# Altium project FLEXI_HAL_2000.PrjPCB (part 1 of 3)
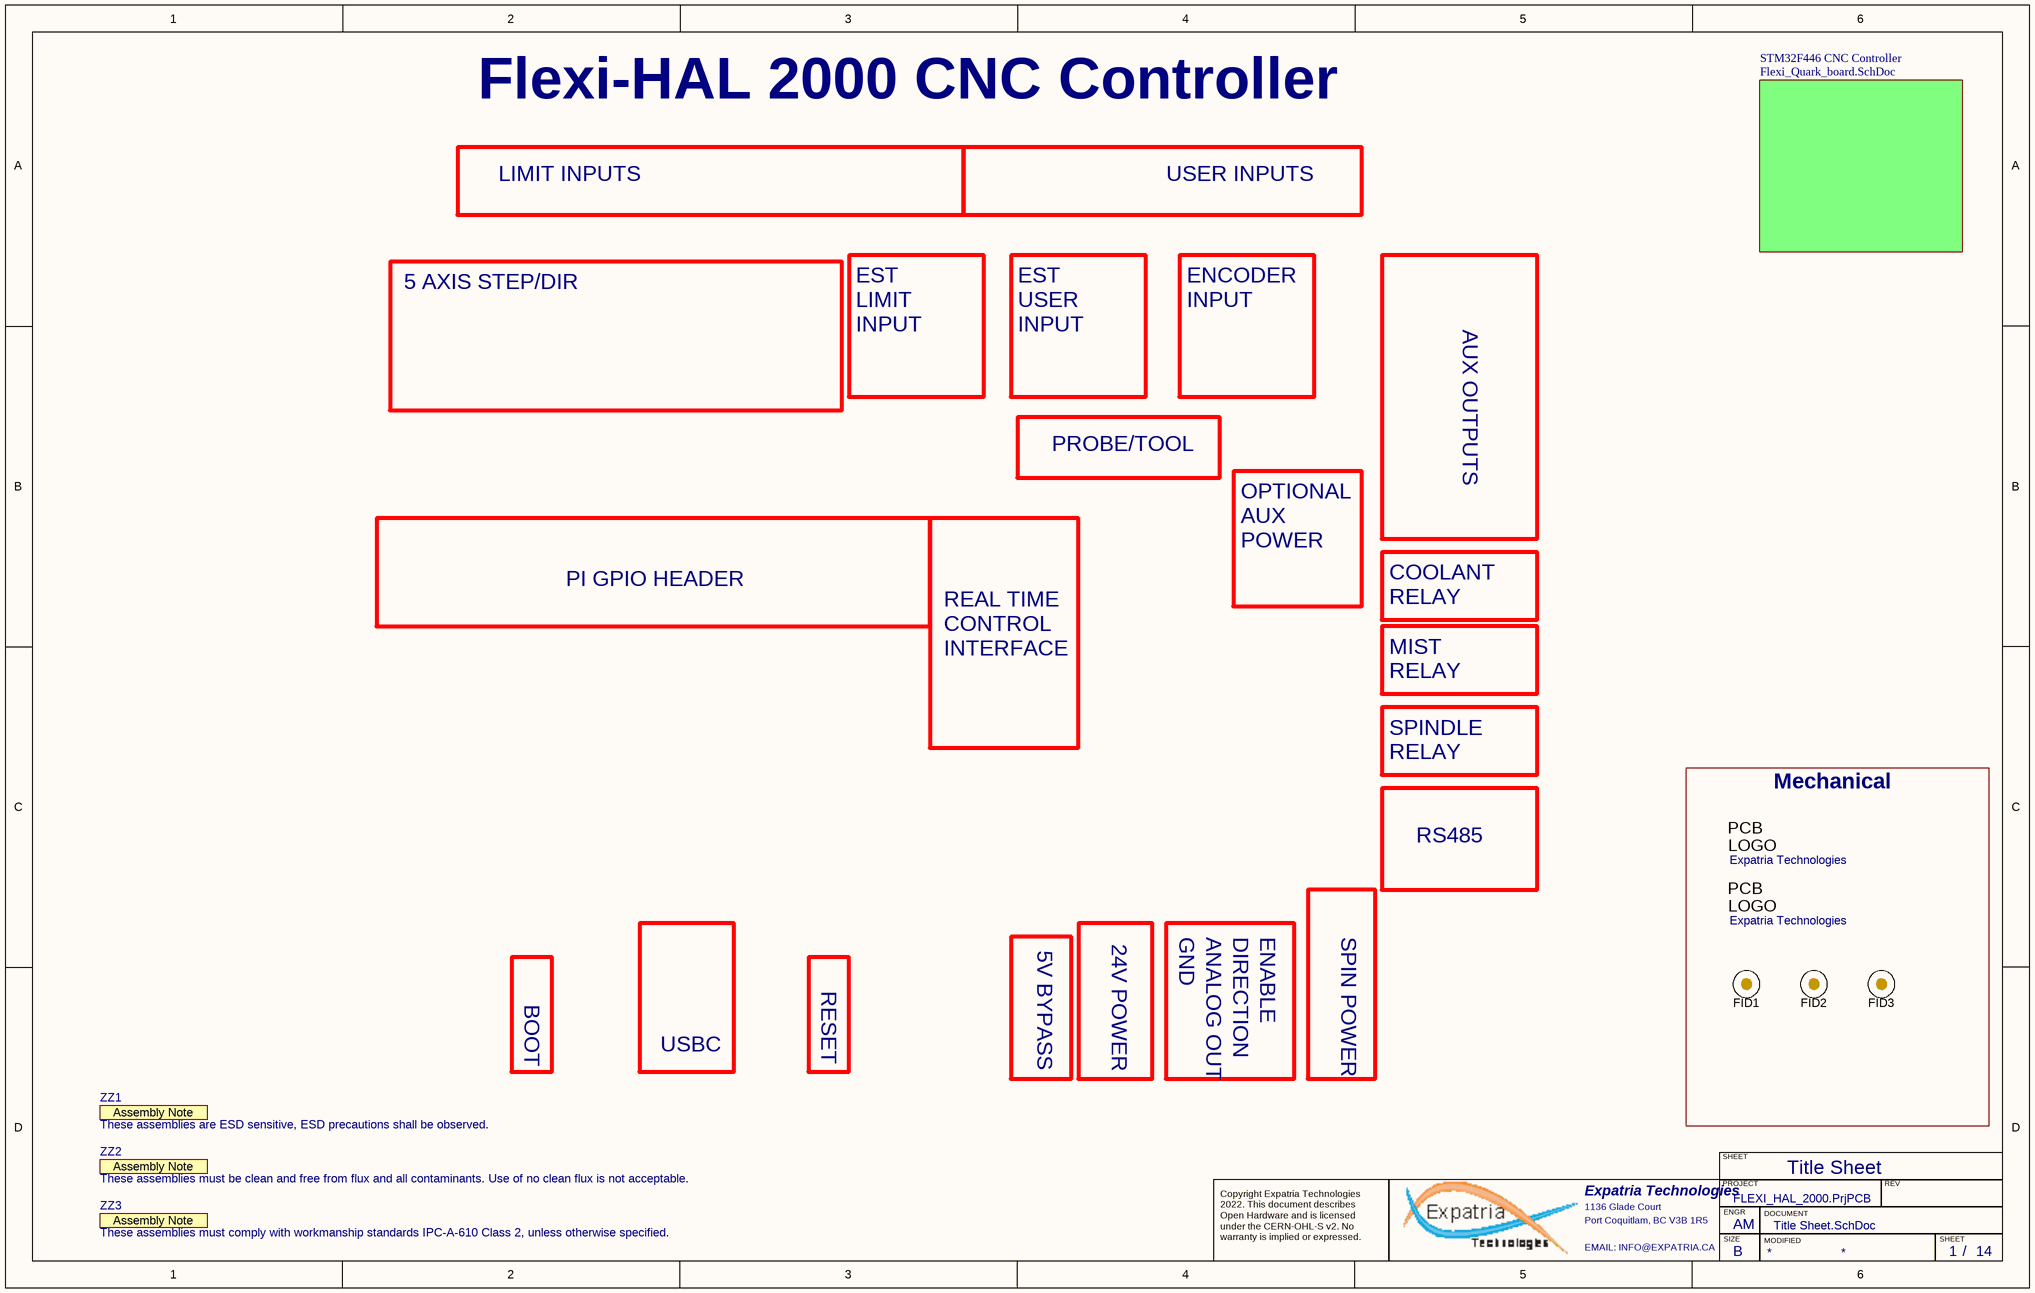
[diagram p0: Title Sheet.SchDoc]
PCBPARTNO: Flexi-HAL 2000; PCBREVNO: A5; Title: Flexi-HAL 2000; VarRevNo: A5
14 sheets, 321 parts. Net scope: hierarchical (ports join the sheet entries above them; power ports are global).
Board file: STMF446_CNC_board.pcbdoc
Sheets:
  Title Sheet.SchDoc
  2xparallelswitch.SchDoc
  STM32F446RE_board.SchDoc
    LIM_SW = Limit_Switches.SchDoc
      PH_DR = Photocoupler12Vinput.SchDoc
      PH_DR = Photocoupler12Vinput.SchDoc
      PH_DR = Photocoupler12Vinput.SchDoc
      PH_DR = Photocoupler12Vinput.SchDoc
      PH_DR = Photocoupler12Vinput.SchDoc
      PH_DR = Photocoupler12Vinput.SchDoc
    USR_SW = Misc_switches.SchDoc
      PH_CY = Photocoupler12Vinput.SchDoc
      PH_FD = Photocoupler12Vinput.SchDoc
      PH_DR = Photocoupler12Vinput.SchDoc
      PH_TL = Photocoupler12Vinput.SchDoc
      PH_PR = Photocoupler12Vinput.SchDoc
    ST = Stepper_driver_group.SchDoc
    SPINDLE = Spindle_Control.SchDoc
    MODBUS = RS485.SchDoc
    Microcontroller = MCU_STM32F446RE.SchDoc
    5V_Supply = 5V_Power_Supply.SchDoc
    AUX_OUTPUTS = Aux_Outputs.SchDoc
  2xparallelswitch_HALT.SchDoc
  MCU_STM32G0_Extender.SchDoc

## Sheet Title Sheet.SchDoc: STM32F446 CNC
size B; Author: AM; CompanyName: Expatria Technologies; DrawnBy: A.Marles; Engineer: AM; Organization: Expatria Technolgoies; DocumentNumber: 1; Revision: A5; SheetNumber: 1; SheetTotal: 14

### Parts
FID1  Fiducial  [Fiducial10-20]  (value not drawn)  (no BOM)
FID2  Fiducial  [Fiducial10-20]  (value not drawn)  (no BOM)
FID3  Fiducial  [Fiducial10-20]  (value not drawn)  (no BOM)
Logo1  Expatria Technologies  [Expatria-Logo]  (no BOM)
Logo2  Expatria Technologies  [Expatria-Logo]  (no BOM)
ZZ1  These assemblies are ESD sensitive, ESD precautions shall be observed.  [AssemblyNote]  (graphical)
ZZ2  These assemblies must be clean and free from flux and all contaminants. Use of no clean flux is not acceptable.  [AssemblyNote]  (graphical)
ZZ3  These assemblies must comply with workmanship standards IPC-A-610 Class 2, unless otherwise specified.  [AssemblyNote]  (graphical)

### Blocks framed on the sheet
Mechanical: FID1-FID3 Logo1 Logo2

### Sub-sheets
STM32F446 CNC Controller = Flexi_Quark_board.SchDoc (file not in this document): no entries

### Notes on the sheet
- Flexi-HAL 2000 CNC Controller
- LIMIT INPUTS
- USER INPUTS
- 5 AXIS STEP/DIR
- EST
  LIMIT
  INPUT
- EST
  USER
  INPUT
- ENCODER
  INPUT
- AUX OUTPUTS
- PROBE/TOOL
- OPTIONAL
  AUX
  POWER
- PI GPIO HEADER
- COOLANT
  RELAY
- MIST
  RELAY
- SPINDLE
  RELAY
- REAL TIME CONTROL INTERFACE
- RS485
- 5V BYPASS
- 24V POWER
- GND
- ANALOG OUT
- DIRECTION
- ENABLE
- SPIN POWER
- BOOT
- RESET
- USBC
- Title Sheet
- SHEET
- Expatria Technologies
- 1136 Glade Court
- Port Coquitlam, BC V3B 1R5
- PROJECT
- SIZE
- ENGR
- MODIFIED
- DOCUMENT
- REV
- Copyright Expatria Technologies 2022. This document describes Open Hardware and is licensed under the CERN-OHL-S v2. No warranty is implied or expressed.
- EMAIL: INFO@EXPATRIA.CA
- B
- /
- (in symbol AssemblyNote) Assembly Note
- (in symbol SBT-Logo) PCB; LOGO

### Library data of the parts
FID1-FID3 = Fiducial: FIDUCIAL NO ASSEMBLY; Manufacturer 1: NONE; Manufacturer Part Number 1: NONE; Value: Fiducial
Logo1 Logo2 = SBT-Logo: Manufacturer 1: NONE; Value: Expatria Logo; Manufacturer Part Number 1: NONE
ZZ1-ZZ3 = AssemblyNote: SymbolCreator: codlsc; SymbolVersion: 2010-05-18; CompType: AssemblyNote; ClassName: AssemblyNote; Publisher: Texas Instruments; LatestRevisionDate: 2012-06-14; LatestRevisionNote: Initial Version; Alternate Manufacturer: -; Alternate PartNumber: -; Parameter 1: *

## Sheet 2xparallelswitch.SchDoc: RP2040 CNC
size B; Author: AM; CompanyName: Expatria Technologies; DrawnBy: A.Marles; Engineer: AM; Organization: Expatria Technolgoies; DocumentNumber: 13; Revision: A5; SheetNumber: 13; SheetTotal: 14
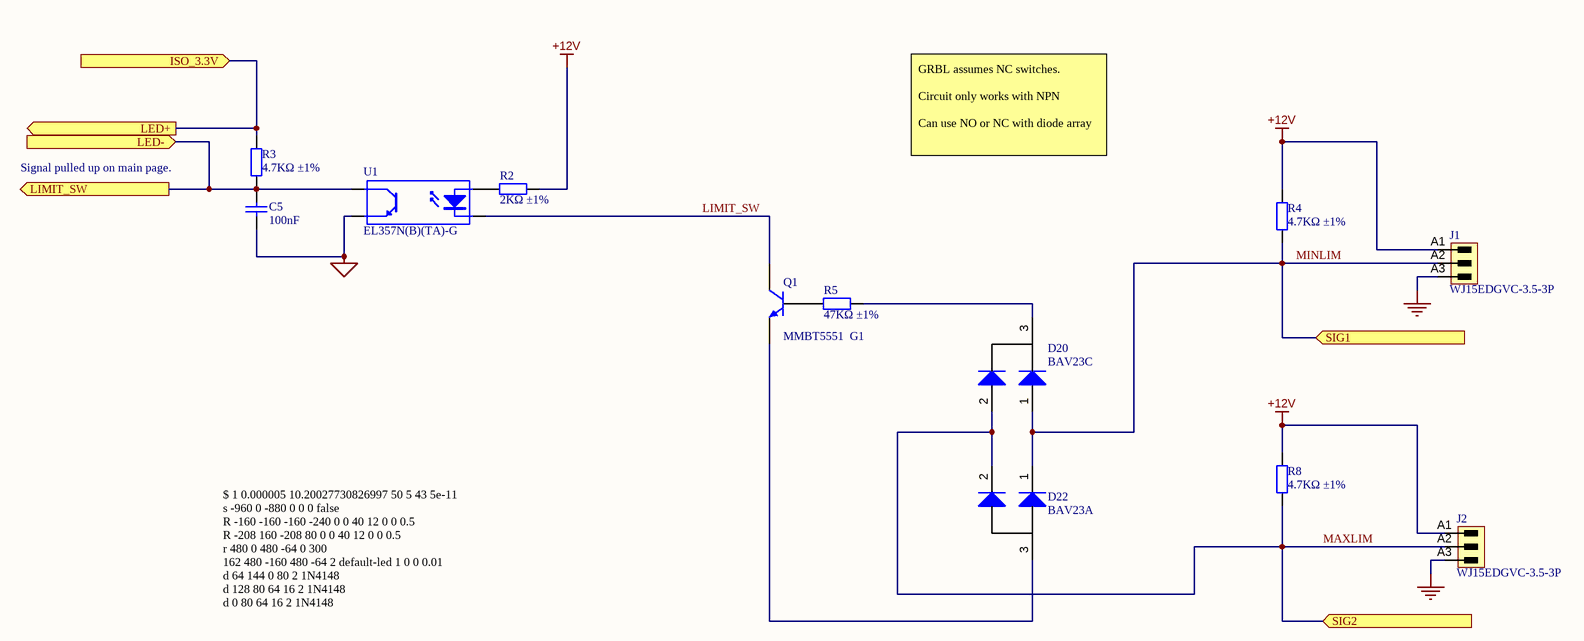
[diagram p1: 2xparallelswitch.SchDoc]

### Parts
(Parts that share a designator on the sheet are numbered #1, #2 ... from top to bottom, then left to right.)
C5#1  100nF  [0603_C]
D20  BAV23C  [SOT-23(SOT-23-3)]
D22  BAV23A  [SOT-23(SOT-23-3)]
J1#1  WJ15EDGVC-3.5-3P  [691321100003 - 3.5mm  3p]
J2#1  WJ15EDGVC-3.5-3P  [691321100003 - 3.5mm  3p]
Q1#1  MMBT5551  G1  [SOT-23(SOT-23-3)]
R2#1  2KΩ ±1%  [0603_R]
R3#1  4.7KΩ ±1%  [0603_R]
R4#1  4.7KΩ ±1%  [0603_R]
R5#1  47KΩ ±1%  [0603_R]
R8#1  4.7KΩ ±1%  [0603_R]
U1#1  EL357N(B)(TA)-G  [SOP-4_P2.54]

### Ports
ISO_3.3V (in), LED+ (out), LED- (in), LIMIT_SW (out), SIG1 (in), SIG2 (in)

### Nets
+12V: J1#1.A1 J2#1.A1 R2#1.2 R4#1.2 R8#1.2
GND: J1#1.A3 J2#1.A3
MCU_GND: C5#1.1 U1#1.3(E)
ISO_3.3V: R3#1.2 ; port LED+, port ISO_3.3V
LED-: C5#1.2 R3#1.1 U1#1.4(C) ; port LIMIT_SW, port LED-
LIMIT_SW: Q1#1.3(C) U1#1.2(K)
MAXLIM: D20.2(A) D22.2(K) J2#1.A2 R8#1.1 ; port SIG2
MINLIM: D20.1(A) D22.1(K) J1#1.A2 R4#1.1 ; port SIG1
NetD20_3: D20.3(K) R5#1.1
NetD22_3: D22.3(A) Q1#1.2(E)
NetQ1#1_1: Q1#1.1(B) R5#1.2
NetR2#1_1: R2#1.1 U1#1.1(A)

### Notes on the sheet
- Signal pulled up on main page.
- GRBL assumes NC switches.
  Circuit only works with NPN
  Can use NO or NC with diode array
- $ 1 0.000005 10.20027730826997 50 5 43 5e-11
  s -960 0 -880 0 0 0 false
  R -160 -160 -160 -240 0 0 40 12 0 0 0.5
  R -208 160 -208 80 0 0 40 12 0 0 0.5
  r 480 0 480 -64 0 300
  162 480 -160 480 -64 2 default-led 1 0 0 0.01
  d 64 144 0 80 2 1N4148
  d 128 80 64 16 2 1N4148
  d 0 80 64 16 2 1N4148
  d 64 144 128 80 2 1N4148
  w -208 240 -64 240 0
  w -208 -48 -64 -48 0
  r -208 -160 -208 -48 0 4700
  r -208 240 -208 160 0 4700
  w -272 240 -208 240 0
  r -816 -128 -816 -16 0 4700
  368 560 0 640 0 0 0
  w 128 80 176 80 0
  w 176 80 176 -48 0
  w -64 -48 176 -48 0
  w -64 240 -64 80 0
  w -64 80 0 80 0
  t 432 16 480 16 0 1 -1.9259651808153881 0.6654412315562044 100 default
  w -208 -160 -160 -160 0
  w 480 32 480 112 0
  w 64 16 320 16 0
  r 320 16 432 16 0 47000
  w 480 -160 560 -160 0
  w 480 0 560 0 0
  w 64 144 480 144 0
  w 480 112 480 144 0
  t -880 0 -816 0 0 1 0.5853792388006339 0.6306931131090543 100 default
  r -736 -16 -816 -16 0 330
  g -816 96 -816 160 0 0
  r -960 0 -1056 0 0 4700
  R -1056 0 -1056 -80 0 0 40 4 0 0 0.5
  368 432 16 432 -32 0 0
  w -160 -160 -64 -160 0
  w -64 -160 480 -160 0
  R -816 -128 -816 -208 0 0 40 12 0 0 0.5
  r -816 16 -816 96 0 5
  w -272 240 -272 368 0
  g -144 16 -176 16 0 0
  r -144 16 -64 16 0 400
  r -144 16 -144 80 0 4700
  R -144 80 -144 112 0 0 40 12 0 0 0.5
  s -64 16 -64 -48 0 1 false
  368 -64 -48 -64 -96 0 0
  s -736 -16 -672 -16 0 1 false
  w -208 -48 -272 -48 0
  w -496 -48 -432 -48 0
  w -496 368 -432 368 0
  s -432 -48 -272 -48 0 0 false
  s -432 368 -272 368 0 0 false
  s -672 400 -752 400 0 0 false
  r -752 400 -752 480 0 1
  g -752 480 -752 544 0 0
  g -496 128 -496 192 0 0
  w -672 -16 -592 -16 0
  370 -496 -16 -496 64 1 0 0
  r -576 -320 -576 -256 0 2000
  R -576 -320 -576 -368 0 0 40 12 0 0 0.5
  162 -576 -256 -576 -176 2 default-led 1 0 0 0.01
  w -592 -16 -592 -32 0
  368 -592 -32 -592 -80 0 0
  f -624 -160 -576 -160 32 1.5 0.00125
  g -576 -144 -576 -112 0 0
  w -672 -16 -672 -160 0
  r -544 -32 -592 -32 0 2000
  w -672 -160 -624 -160 0
  t -544 -32 -496 -32 0 -1 11.999998764889913 0.7005262762564612 100 default
  t -544 384 -496 384 0 -1 1.6935934957562468 -0.6687444541435765 100 default
  w -672 256 -624 256 0
  r -544 384 -592 384 0 10000
  w -672 400 -672 256 0
  g -576 272 -576 304 0 0
  f -624 256 -576 256 32 1.5 0.00125
  368 -592 384 -592 336 0 0
  w -592 400 -592 384 0
  162 -576 160 -576 240 2 default-led 1 0 0 0.01
  R -576 96 -576 48 0 0 40 12 0 0 0.5
  r -576 96 -576 160 0 2000
  370 -496 400 -496 480 1 0 0
  w -672 400 -592 400 0
  g -496 480 -496 544 0 0
  r -672 -160 -672 -224 0 100000
  w -672 -224 -672 -320 0
  w -672 -320 -576 -320 0
  r -496 64 -496 128 0 4
  g -416 432 -416 464 0 0
- SHEET
- Expatria Technologies
- 1136 Glade Court
- Port Coquitlam, BC V3B 1R5
- PROJECT
- SIZE
- ENGR
- MODIFIED
- DOCUMENT
- REV
- Copyright Expatria Technologies 2022. This document describes Open Hardware and is licensed under the CERN-OHL-S v2. No warranty is implied or expressed.
- EMAIL: INFO@EXPATRIA.CA
- B
- /

### Library data of the parts
C5#1 = 0603 100nF (104) 10% 50V: Chip capacitors; Manufacturer: YAGEO; PartNumber: CC0603KRX7R9BB104; Tolerance: 10%; Voltage: 50V; ComponentLink1Description: Supplier link; ComponentLink1URL: http://www.szlcsc.com/product/details_15331.html; Package: 0603; Supplier: LC; SuppliersPartNumber: C14663; Capacitance: 100nF
D20 = SOT-23 BAV23C: 250V +150℃@(Tj) 350mW Dual Common Cathode 1.25V@200mA 50ns 100nA@250V 225mA SOT-23 Switching Diode ROHS; ComponentLink1Description: 供应商链接; ComponentLink1URL: http://www.szlcsc.com/product/details_70091.html; Package: SOT-23; Supplier: LC; SuppliersPartNumber: C545540
D22 = SOT-23 BAV23A: 200V -65℃~+150℃@(Tj) 350mW 1 Pair Common Anode 1.25V@200mA 50ns 100nA@200V 400mA SOT-23 Switching Diode ROHS; ComponentLink1Description: 供应商链接; ComponentLink1URL: http://www.szlcsc.com/product/details_70091.html; Package: SOT-23; Supplier: LC; SuppliersPartNumber: C328584
J1#1 J2#1 = 3.5mm Terminal Header 3p: Header,Male Pin,Covered(4 Sided) 3 1 0.138"（3.50mm） 3 P=3.5mm Pluggable System Terminal Block RoHS; Manufacturer: Weidmueller; Manufacturer 1: Weidmuller; Manufacturer Part Number 1: 1604480000; Pitch_mm: 3.5 mm; UL_94_flammability_rating: V-0; Side_termination_characteristic: closed side; Solder_pin_length_mm: 3.2 mm; Short_text_for_material: SL 3.50/03/180G 3.2SN OR BX; Pitch_inch: 0.138 inch; PartNumber: WJ15EDGVC-3.5-3P; PackageReference: SL_3_50_180G_03; ComponentLink1URL: http://www.weidmueller.com/; ComponentLink1Description: Manufacturer URL; Packaging: Box; Revision: V1; SuppliersPartNumber: C192778
Q1#1 = SOT-23 MMBT5551  G1: 三极管; ComponentLink1Description: 供应商链接; ComponentLink1URL: http://www.szlcsc.com/product/details_2502.html; Package: SOT-23; Supplier: LC; SuppliersPartNumber: C2145
R2#1 = 0603 2K (2001) 1%: Chip resistor; Manufacturer: Uniroyal Elec; PartNumber: 0603WAF2001T5E; Power: 1/10W; ComponentLink1Description: Supplier link; ComponentLink1URL: http://www.szlcsc.com/product/details_23702.html; Package: 0603; Supplier: LC; SuppliersPartNumber: C22975; Resistance: 2KΩ; Tolerance: 1%
R3#1 R4#1 R8#1 = 0603 4.7K (4701) 1%: Chip resistor; Manufacturer: Uniroyal Elec; PartNumber: 0603WAF4701T5E; Power: 1/10W; ComponentLink1Description: Supplier link; ComponentLink1URL: http://www.szlcsc.com/product/details_23889.html; Package: 0603; Supplier: LC; SuppliersPartNumber: C23162; Resistance: 4.7KΩ; Tolerance: 1%
R5#1 = 0603 47K (4702) 1%: Chip resistor; Manufacturer: Uniroyal Elec; PartNumber: 0603WAF4702T5E; Power: 1/10W; ComponentLink1Description: Supplier link; ComponentLink1URL: http://www.szlcsc.com/product/details_26562.html; Package: 0603; Supplier: LC; SuppliersPartNumber: C25819; Resistance: 47KΩ; Tolerance: 1%
U1#1 = EL357N(B)(TA)-G_[C6649]: 贴片光耦; ComponentLink1Description: 供应商链接; ComponentLink1URL: http://www.szlcsc.com/product/details_7114.html; Package: SOP-4_P2.54; Supplier: LC; SuppliersPartNumber: C6649

## Sheet STM32F446RE_board.SchDoc: RP2040 CNC
size C; Author: AM; CompanyName: Expatria Technologies; DrawnBy: A.Marles; Engineer: AM; Organization: Expatria Technolgoies; Address1: Schematic; DocumentNumber: 2; Revision: A5; SheetNumber: 2; SheetTotal: 14
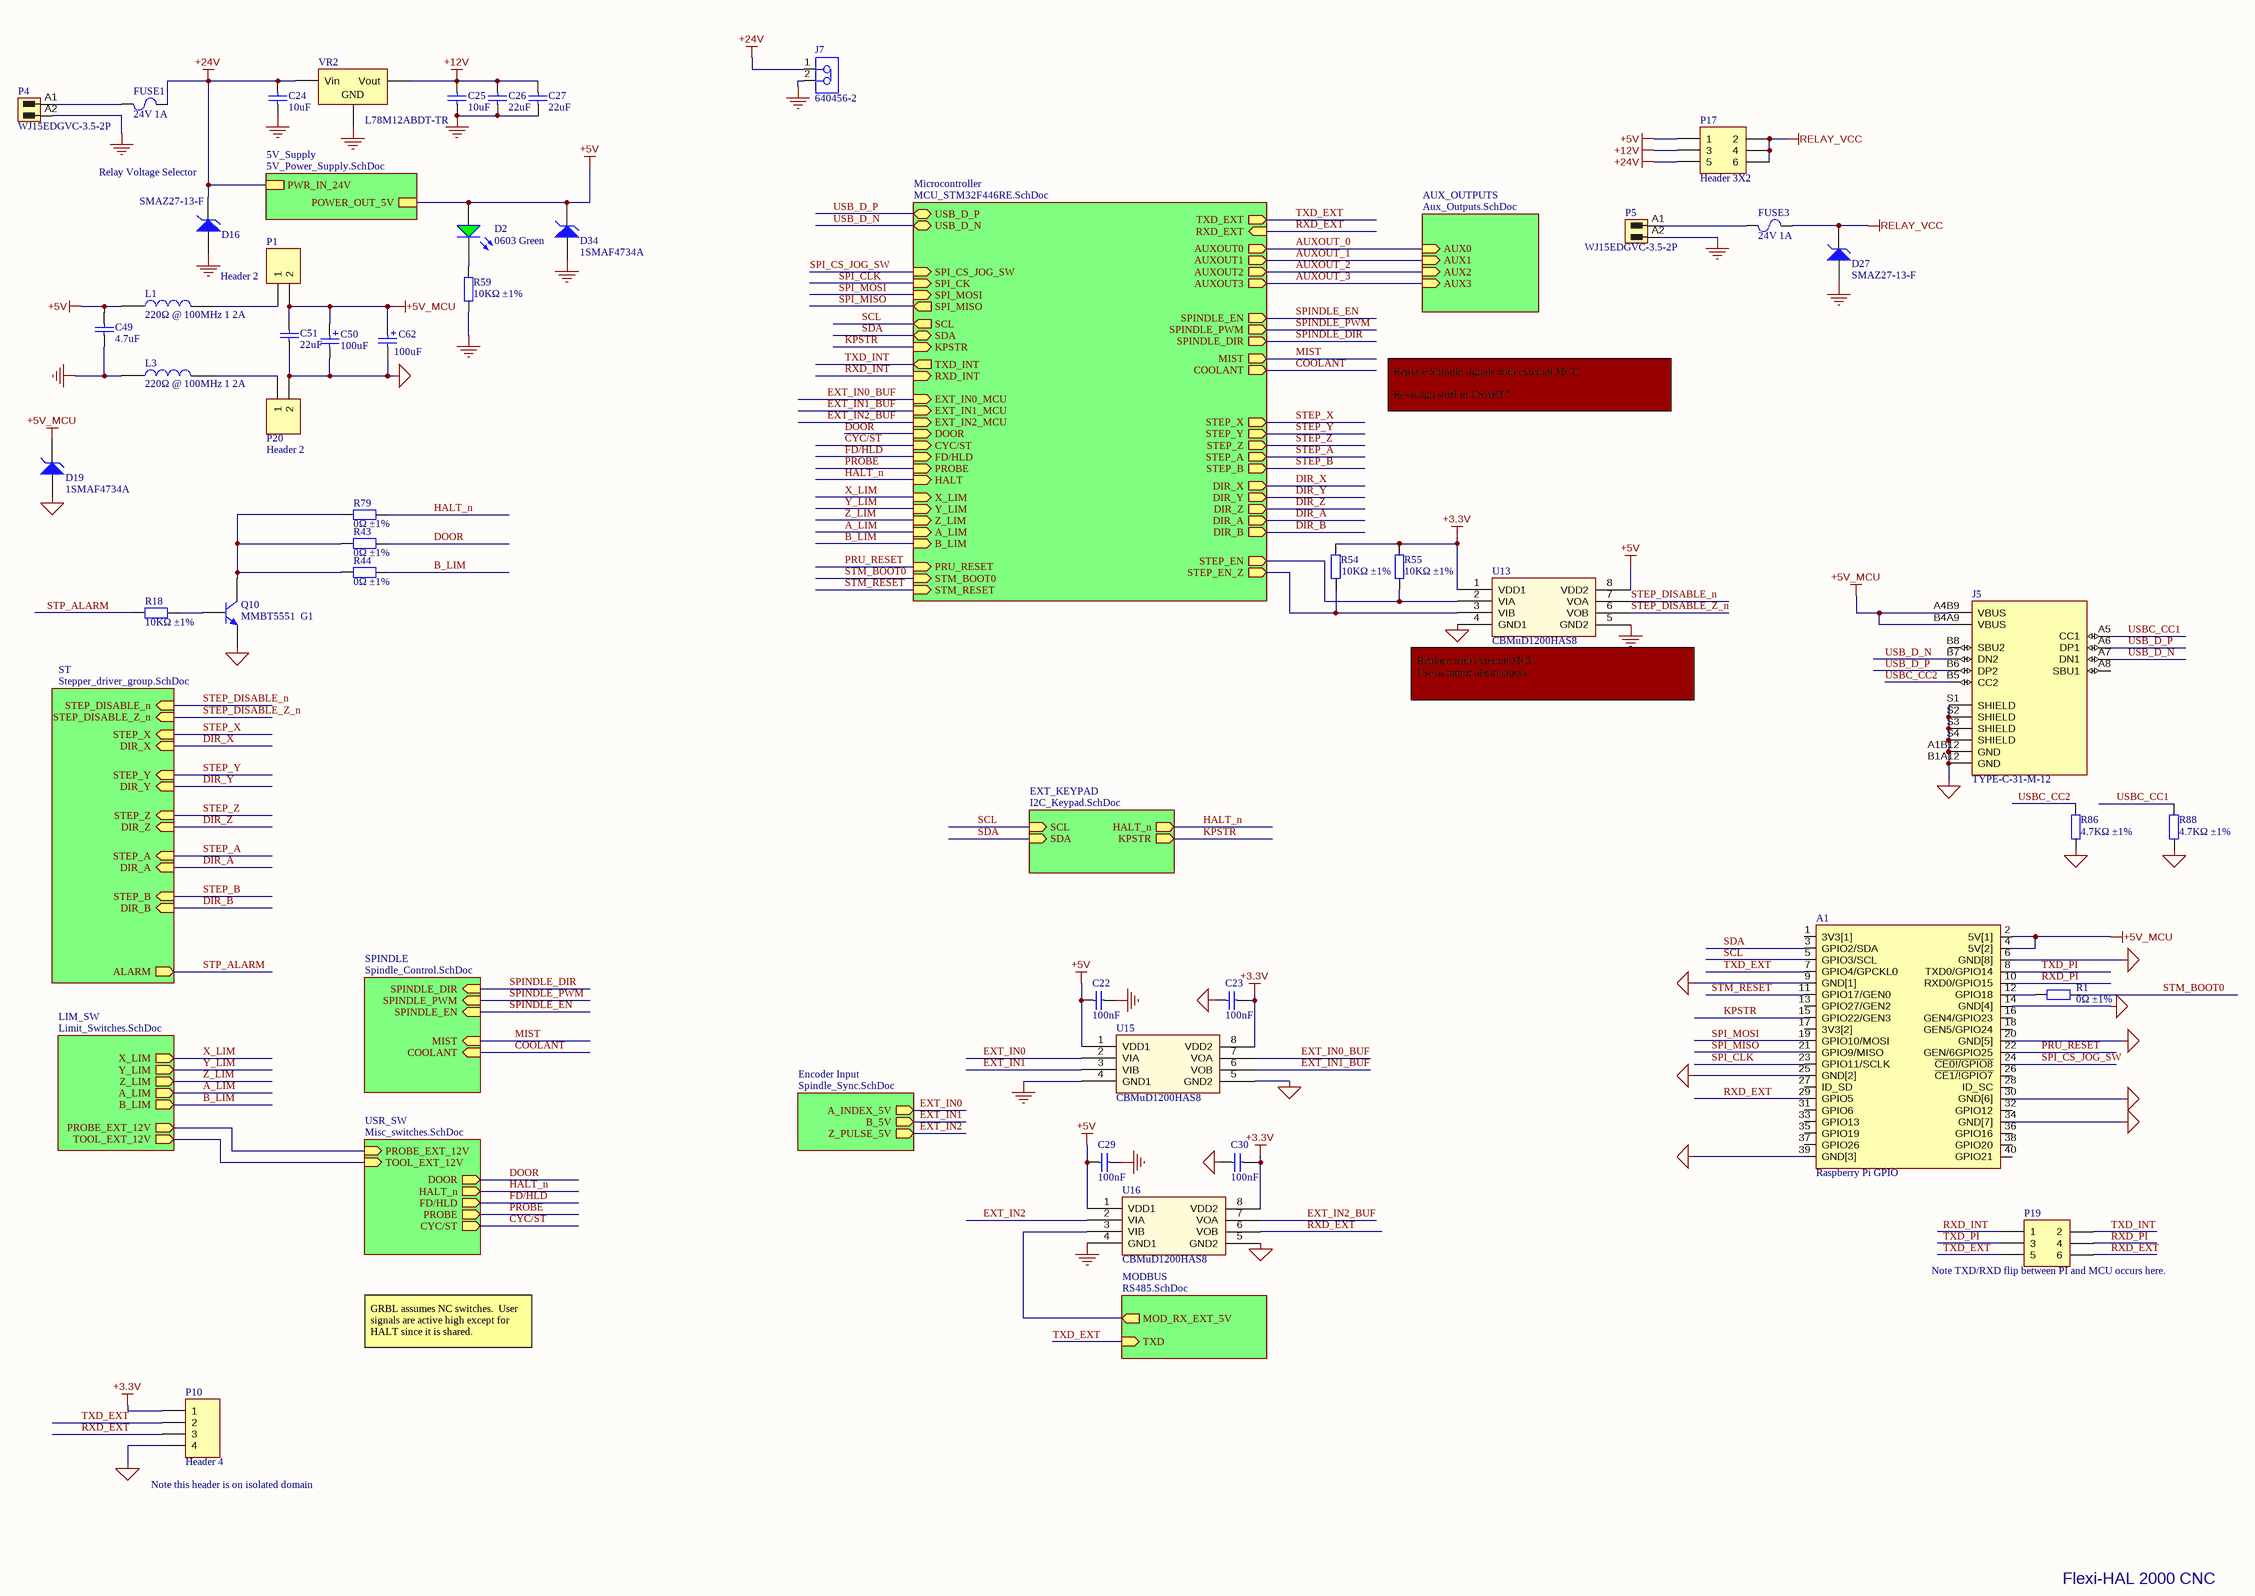
[diagram p2: STM32F446RE_board.SchDoc]

### Parts
(Parts that share a designator on the sheet are numbered #1, #2 ... from top to bottom, then left to right.)
A1  Raspberry Pi GPIO  [MODULE_RASPBERRY_PI_4_MODEL_B]
C22  100nF  [0603_C]
C23  100nF  [0603_C]
C24  10uF  [1206_C]
C25  10uF  [1206_C]
C26  22uF  [0805_C]
C27  22uF  [0805_C]
C29  100nF  [0603_C]
C30  100nF  [0603_C]
C49  4.7uF  [0603_C]
C50  100uF  [CASE-B_3528]
C51  22uF  [0805_C]
C62  100uF  [WCAP-ASLI_D6.3H7.7]
D2  0603 Green  [0603_LED_S1]
D16  SMAZ27-13-F  [DIOM5226X240N]
D19  1SMAF4734A  [DIOM5226X240N]
D27  SMAZ27-13-F  [DIOM5226X240N]
D34  1SMAF4734A  [DIOM5226X240N]
FUSE1#1  24V 1A  [1206_C]
FUSE3  24V 1A  [1206_C]
J5  TYPE-C-31-M-12  [HRO_TYPE-C-31-M-12]
J7  640456-2  [TECO-640456-2_V]
L1  220Ω @ 100MHz 1 2A  [0805_C]
L3  220Ω @ 100MHz 1 2A  [0805_C]
P1  Header 2  [HDR1X2]
P4#1  WJ15EDGVC-3.5-2P  [691321100002]
P5#1  WJ15EDGVC-3.5-2P  [691321100002]
P10  Header 4  [HDR1X4]
P17  Header 3X2  [HDR2X3]
P19  Header 3X2  [HDR2X3]  (value not drawn)
P20  Header 2  [HDR1X2]
Q10  MMBT5551  G1  [SOT-23(SOT-23-3)]
R1  0Ω ±1%  [0603_R]
R18#1  10KΩ ±1%  [0603_R]
R43  0Ω ±1%  [0603_R]
R44  0Ω ±1%  [0603_R]
R54  10KΩ ±1%  [0603_R]
R55#1  10KΩ ±1%  [0603_R]
R59  10KΩ ±1%  [0603_R]
R79  0Ω ±1%  [0603_R]
R86  4.7KΩ ±1%  [0603_R]
R88  4.7KΩ ±1%  [0603_R]
U13#1  CBMuD1200HAS8  [SOIC-8_150mil]
U15  CBMuD1200HAS8  [SOIC-8_150mil]
U16  CBMuD1200HAS8  [SOIC-8_150mil]
VR2  L78M12ABDT-TR  [TO-252-2-180]

### Sub-sheets
5V_Supply = 5V_Power_Supply.SchDoc: POWER_OUT_5V, PWR_IN_24V
AUX_OUTPUTS = Aux_Outputs.SchDoc: AUX3 (in), AUX0 (in), AUX1 (in), AUX2 (in)
Encoder Input = Spindle_Sync.SchDoc (file not in this document): A_INDEX_5V (out), Z_PULSE_5V (out), B_5V (out)
EXT_KEYPAD = I2C_Keypad.SchDoc (file not in this document): HALT_n (out), SCL (in), KPSTR (out), SDA (in)
LIM_SW = Limit_Switches.SchDoc: Y_LIM (out), Z_LIM (out), X_LIM (out), A_LIM (out), B_LIM (out), PROBE_EXT_12V (out), TOOL_EXT_12V (out)
Microcontroller = MCU_STM32F446RE.SchDoc: USB_D_P (bidir), EXT_IN2_MCU (in), DIR_B (out), EXT_IN1_MCU (in), RXD_INT (in), DIR_Y (out), EXT_IN0_MCU (in), USB_D_N (bidir), DIR_X (out), STEP_B (out), TXD_INT (out), STEP_A (out), SPI_CK (in), SPINDLE_PWM (out), STEP_Z (out), STEP_Y (out), SPI_MISO (out), SPI_MOSI (in), FD/HLD (in), STEP_X (out), CYC/ST (in), SPI_CS_JOG_SW (in), PROBE (in), AUXOUT3 (out), MIST (out), TXD_EXT (out), SDA (bidir), AUXOUT2 (out), AUXOUT0 (out), A_LIM (in), SCL (out), DIR_Z (out), KPSTR (in), RXD_EXT (in), COOLANT (out), SPINDLE_DIR (out), SPINDLE_EN (out), HALT (in), AUXOUT1 (out), DIR_A (out), PRU_RESET (in), X_LIM (in), Z_LIM (in), STM_BOOT0 (in), Y_LIM (in), STEP_EN (out), B_LIM (in), DOOR (in), STM_RESET (in), STEP_EN_Z (out)
MODBUS = RS485.SchDoc: TXD (in), MOD_RX_EXT_5V (out)
SPINDLE = Spindle_Control.SchDoc: SPINDLE_EN (in), SPINDLE_DIR (in), SPINDLE_PWM (in), COOLANT (in), MIST (in)
ST = Stepper_driver_group.SchDoc: STEP_Z (in), DIR_Z (in), STEP_X (in), STEP_B (in), DIR_X (in), DIR_A (in), DIR_Y (in), STEP_Y (in), DIR_B (in), STEP_A (in), ALARM (out), STEP_DISABLE_n (in), STEP_DISABLE_Z_n (in)
USR_SW = Misc_switches.SchDoc: FD/HLD (out), PROBE (out), CYC/ST (out), HALT_n (out), DOOR (out), PROBE_EXT_12V (in), TOOL_EXT_12V (in)

### Nets
+3.3V: C23.2 C30.2 P10.1 R54.1 R55#1.1 U13#1.1(VDD1) U15.8(VDD2) U16.8(VDD2)
+5V: C22.1 C29.1 C49.2 D2.A D34.2(K) L1.1 P17.1 U13#1.8(VDD2) U15.1(VDD1) U16.1(VDD1) ; sheet 5V_Supply/POWER_OUT_5V
+5V_MCU: A1.2(5V[1]) A1.4(5V[2]) C50.1 C51.2 C62.1(P) D19.2(K) J5.A4B9(VBUS) J5.B4A9(VBUS) P1.2
+12V: C25.2 C26.2 C27.2 P17.3 VR2.3(Vout)
+24V: C24.2 D16.2(K) FUSE1#1.2 J7.1 P17.5 VR2.1(Vin) ; sheet 5V_Supply/PWR_IN_24V
GND: C22.2 C24.1 C25.1 C26.1 C27.1 C29.2 C49.1 D16.1(A) D27.1(A) D34.1(A) J7.2 L3.1 P4#1.A2 P5#1.A2 R59.1 U13#1.5(GND2) U15.4(GND1) U16.4(GND1) VR2.2(GND)
MCU_GND: A1.6(GND[8]) A1.9(GND[1]) A1.14(GND[4]) A1.20(GND[5]) A1.25(GND[2]) A1.30(GND[6]) A1.34(GND[7]) A1.39(GND[3]) C23.1 C30.1 C50.2 C51.1 C62.2(N) D19.1(A) J5.A1B12(GND) J5.B1A12(GND) J5.S1(SHIELD) J5.S2(SHIELD) J5.S3(SHIELD) J5.S4(SHIELD) P10.4 P20.2 Q10.2(E) R86.2 R88.2 U13#1.4(GND1) U15.5(GND2) U16.5(GND2)
RELAY_VCC: D27.2(K) FUSE3.2 P17.2 P17.4 P17.6
A_LIM: sheet LIM_SW/A_LIM, sheet Microcontroller/A_LIM
AUXOUT_0: sheet Microcontroller/AUXOUT0, sheet AUX_OUTPUTS/AUX0
AUXOUT_1: sheet Microcontroller/AUXOUT1, sheet AUX_OUTPUTS/AUX1
AUXOUT_2: sheet Microcontroller/AUXOUT2, sheet AUX_OUTPUTS/AUX2
AUXOUT_3: sheet Microcontroller/AUXOUT3, sheet AUX_OUTPUTS/AUX3
B_LIM: R44.1 ; sheet LIM_SW/B_LIM, sheet Microcontroller/B_LIM
COOLANT: sheet SPINDLE/COOLANT, sheet Microcontroller/COOLANT
CYC/ST: sheet USR_SW/CYC/ST, sheet Microcontroller/CYC/ST
DIR_A: sheet ST/DIR_A, sheet Microcontroller/DIR_A
DIR_B: sheet ST/DIR_B, sheet Microcontroller/DIR_B
DIR_X: sheet ST/DIR_X, sheet Microcontroller/DIR_X
DIR_Y: sheet ST/DIR_Y, sheet Microcontroller/DIR_Y
DIR_Z: sheet ST/DIR_Z, sheet Microcontroller/DIR_Z
DOOR: R43.1 ; sheet USR_SW/DOOR, sheet Microcontroller/DOOR
EXT_IN0: U15.2(VIA) ; sheet Encoder Input/A_INDEX_5V
EXT_IN0_BUF: U15.7(VOA) ; sheet Microcontroller/EXT_IN0_MCU
EXT_IN1: U15.3(VIB) ; sheet Encoder Input/B_5V
EXT_IN1_BUF: U15.6(VOB) ; sheet Microcontroller/EXT_IN1_MCU
EXT_IN2: U16.2(VIA) ; sheet Encoder Input/Z_PULSE_5V
EXT_IN2_BUF: U16.7(VOA) ; sheet Microcontroller/EXT_IN2_MCU
FD/HLD: sheet USR_SW/FD/HLD, sheet Microcontroller/FD/HLD
HALT_n: R79.1 ; sheet USR_SW/HALT_n, sheet EXT_KEYPAD/HALT_n, sheet Microcontroller/HALT
KPSTR: A1.15(GPIO22/GEN3) ; sheet EXT_KEYPAD/KPSTR, sheet Microcontroller/KPSTR
MIST: sheet SPINDLE/MIST, sheet Microcontroller/MIST
PROBE: sheet USR_SW/PROBE, sheet Microcontroller/PROBE
PRU_RESET: A1.22(GEN/6GPIO25) ; sheet Microcontroller/PRU_RESET
RXD_EXT: A1.29(GPIO5) P10.3 P19.6 U16.6(VOB) ; sheet Microcontroller/RXD_EXT
RXD_INT: P19.1 ; sheet Microcontroller/RXD_INT
RXD_PI: A1.10(RXD0/GPIO15) P19.4
SCL: A1.5(GPIO3/SCL) ; sheet EXT_KEYPAD/SCL, sheet Microcontroller/SCL
SDA: A1.3(GPIO2/SDA) ; sheet EXT_KEYPAD/SDA, sheet Microcontroller/SDA
SPI_CLK: A1.23(GPIO11/SCLK) ; sheet Microcontroller/SPI_CK
SPI_CS_JOG_SW: A1.24(~{CE0!/GPIO8}) ; sheet Microcontroller/SPI_CS_JOG_SW
SPI_MISO: A1.21(GPIO9/MISO) ; sheet Microcontroller/SPI_MISO
SPI_MOSI: A1.19(GPIO10/MOSI) ; sheet Microcontroller/SPI_MOSI
SPINDLE_DIR: sheet SPINDLE/SPINDLE_DIR, sheet Microcontroller/SPINDLE_DIR
SPINDLE_EN: sheet SPINDLE/SPINDLE_EN, sheet Microcontroller/SPINDLE_EN
SPINDLE_PWM: sheet SPINDLE/SPINDLE_PWM, sheet Microcontroller/SPINDLE_PWM
STEP_A: sheet ST/STEP_A, sheet Microcontroller/STEP_A
STEP_B: sheet ST/STEP_B, sheet Microcontroller/STEP_B
STEP_DISABLE_n: U13#1.7(VOA) ; sheet ST/STEP_DISABLE_n
STEP_DISABLE_Z_n: U13#1.6(VOB) ; sheet ST/STEP_DISABLE_Z_n
STEP_X: sheet ST/STEP_X, sheet Microcontroller/STEP_X
STEP_Y: sheet ST/STEP_Y, sheet Microcontroller/STEP_Y
STEP_Z: sheet ST/STEP_Z, sheet Microcontroller/STEP_Z
STM_BOOT0: R1.1 ; sheet Microcontroller/STM_BOOT0
STM_RESET: A1.11(GPIO17/GEN0) ; sheet Microcontroller/STM_RESET
STP_ALARM: R18#1.2 ; sheet ST/ALARM
TXD_EXT: A1.7(GPIO4/GPCKL0) P10.2 P19.5 ; sheet MODBUS/TXD, sheet Microcontroller/TXD_EXT
TXD_INT: P19.2 ; sheet Microcontroller/TXD_INT
TXD_PI: A1.8(TXD0/GPIO14) P19.3
USB_D_N: J5.A7(DN1) J5.B7(DN2) ; sheet Microcontroller/USB_D_N
USB_D_P: J5.A6(DP1) J5.B6(DP2) ; sheet Microcontroller/USB_D_P
USBC_CC1: J5.A5(CC1) R88.1
USBC_CC2: J5.B5(CC2) R86.1
X_LIM: sheet LIM_SW/X_LIM, sheet Microcontroller/X_LIM
Y_LIM: sheet LIM_SW/Y_LIM, sheet Microcontroller/Y_LIM
Z_LIM: sheet LIM_SW/Z_LIM, sheet Microcontroller/Z_LIM
NetA1_12: A1.12(GPIO18) R1.2
NetD2_K: D2.K R59.2
NetFUSE1#1_1: FUSE1#1.1 P4#1.A1
NetFUSE3_1: FUSE3.1 P5#1.A1
NetL1_2: L1.2 P1.1
NetL3_2: L3.2 P20.1
NetQ10_1: Q10.1(B) R18#1.1
NetQ10_3: Q10.3(C) R43.2 R44.2 R79.2
NetR54_2: R54.2 U13#1.3(VIB) ; sheet Microcontroller/STEP_EN_Z
NetR55#1_2: R55#1.2 U13#1.2(VIA) ; sheet Microcontroller/STEP_EN
NetU16_3: U16.3(VIB) ; sheet MODBUS/MOD_RX_EXT_5V
(unnamed): sheet LIM_SW/PROBE_EXT_12V, sheet USR_SW/PROBE_EXT_12V
(unnamed): sheet LIM_SW/TOOL_EXT_12V, sheet USR_SW/TOOL_EXT_12V

Not connected (* = marked no-connect by the designer): A1 1(3V3[1]) 13(GPIO27/GEN2) 16(GEN4/GPIO23) 17(3V3[2]) 18(GEN5/GPIO24) 26(~{CE1/!GPIO7}) 27(ID_SD) 28(ID_SC) 31(GPIO6) 32(GPIO12) 33(GPIO13) 35(GPIO19) 36(GPIO16) 37(GPIO26) 38(GPIO20) 40(GPIO21); J5 A8(SBU1) B8(SBU2)

### Notes on the sheet
- Relay Voltage Selector
- Replace Spindle signals with external MCU
  Re-assign stuff to USART?
- (near U13#1) Replace with external MCU.
  Use as motor alarm inputs
- (near P19) Note TXD/RXD flip between PI and MCU occurs here.
- GRBL assumes NC switches.  User signals are active high except for HALT since it is shared.
- (near P10) Note this header is on isolated domain
- Flexi-HAL 2000 CNC
- Expatria Technologies
- SHEET
- PROJECT
- REV
- 1136 Glade Court
- Port Coquitlam, BC V3B 1R5
- EMAIL: INFO@EXPATRIA.CA
- SIZE
- ENGR
- C
- MODIFIED
- DOCUMENT
- /
- Copyright Expatria Technologies 2022. This document describes Open Hardware and is licensed under the CERN-OHL-S v2. No warranty is implied or expressed.

### Library data of the parts
A1 = ADA3708: Raspberry Pi Zero WH _Zero W with Headers_; MP: DS1023-2*20SF11; MF: CONNFLY Elec; Availability: Unavailable; Package: None; Value: *; Price: None; SuppliersPartNumber: C132132
C22 C23 C29 C30 = 0603 100nF (104) 10% 50V: as C5#1 on sheet 2xparallelswitch; ComponentLink1Description: Supplier link; ComponentLink1URL: http://www.szlcsc.com/product/details_15331.html; Package: 0603; Supplier: LC; SuppliersPartNumber: C14663; Capacitance: 100nF
C24 C25 = 1206 10uF (106) 10% 50V: Chip capacitors; Manufacturer: Samsung Electro-Mechanics; PartNumber: CL31A106KBHNNNE; Tolerance: 10%; Voltage: 50V; ComponentLink1Description: Supplier link; ComponentLink1URL: http://www.szlcsc.com/product/details_14236.html; Package: 1206; Supplier: LC; SuppliersPartNumber: C13585; Capacitance: 10uF
C26 C27 C51 = 0805 22uF (226) 20% 25V: Chip capacitors; Manufacturer: Samsung Electro-Mechanics; PartNumber: CL21A226MAQNNNE; Tolerance: 20%; Voltage: 25V; ComponentLink1Description: Supplier link; ComponentLink1URL: http://www.szlcsc.com/product/details_46786.html; Package: 0805; Supplier: LC; SuppliersPartNumber: C2922481; Capacitance: 22uF
C49 = 0603 4.7uF (475) 10% 16V: Chip capacitors; Manufacturer: Samsung Electro-Mechanics; PartNumber: CL10A475KO8NNNC; Tolerance: 10%; Voltage: 16V; ComponentLink1Description: Supplier link; ComponentLink1URL: http://www.szlcsc.com/product/details_20375.html; Package: 0603; Supplier: LC; SuppliersPartNumber: C19666; Capacitance: 4.7uF
C50 = 3528 100uF (107) 10% 6.3V: Tantalum capacitor; Manufacturer: AVX; PartNumber: TAJB107K006RNJ; Tolerance: 10%; Voltage: 6.3V; ComponentLink1Description: Supplier link; ComponentLink1URL: http://www.szlcsc.com/product/details_16815.html; Package: 3528; Supplier: LC; SuppliersPartNumber: C16133; Capacitance: 100uF
C62 = 865080445010: -45℃~+105℃ 2000hrs@105℃ 100uF 7.7mm 35V 6.3mm ±20% SMD,6.3x7.7mm Aluminum Electrolytic Capacitors - SMD ROHS; Manufacturer: Capxon International Elec; SuppliersPartNumber: C59934; Value: 100uF
D2 = 0603 LED Green: LED; ComponentLink1Description: 供应商链接; ComponentLink1URL: http://www.szlcsc.com/product/details_73152.html; Package: 0603; Supplier: LC; SuppliersPartNumber: C72043; Color: Green
D16 D19 D27 D34 = BZT52C27: 27V ±5% 1W 500nA @ 20.5V SMA(DO-214AC) Zener Diodes RoHS; ComponentLink1Description: 供应商链接; ComponentLink1URL: http://www.szlcsc.com/product/details_8541.html; Supplier: LC
  D16 D27: Package: SMA(DO-214AC); SuppliersPartNumber: C155318
  D19 D34: Package: SMAF; SuppliersPartNumber: C169539
FUSE1#1 FUSE3 = JK-nSMD050-24: 24V 1A 0.1s 1206 PTC Resettable Fuses RoHS; Manufacturer: Jinrui Electronic Materials Co.; Package: 1206; Supplier: LC; SuppliersPartNumber: C369160; PartNumber: JK-nSMD050-24
J5 = TYPE-C-31-M-12: USB Connectors 24 Receptacle 1 8.94*7.3mm RoHS; MF: HRO Electronics Co., Ltd.; Value: *; SnapEDA_Link: https://www.snapeda.com/parts/TYPE-C-31-M-12/HRO%20Electronics%20Co.,%20Ltd./view-part/3228496/?ref=snap; Package: Package; MP: TYPE-C-31-M-12; Price: None; Availability: Unavailable; SuppliersPartNumber: C2765186
J7 = CMP-2000-05417-1: Male Header, Pitch 2.54 mm, 1 x 2 Position, Height 10.49 mm, Tail Length 3.556 mm, -55 to 105 degC, RoHS, Bulk; Manufacturer: TE Connectivity; Standards: RoHSCompliant,ELVCompliant,UL94V-0; Material, Housing: Polyester; Agency Approvals: CSA,UL; Brand/Series: MTA-100Series; Contact Centerline Spacing: 0.100 / in.; Material, Contact: CopperAlloy; Current, Rating: 5 / A; Color, Housing: White; Contact Termination Area Plating: Tin; Special Features: Pinstrip; Number of Positions: 2; Pin Spacing: 0.1 / "; Temperature, Operating: -55to+105 / degC; Angle: Straight; Mount Angle: Vertical; Connector Type: MTA-100; Primary Type: InterconnectSystem; Voltage, Rating: 250 / V; Mounting Hole Size: 0.04 / "; Number of Rows: 1; Termination: Solder; Length, Terminal Post: 0.14 / in.; Manufacturer URL: http://www.te.com/; Color: White; Size, Post: 0.025 / in.; Contact Shape: Square; Mounting Type: PCMount; Datasheet URL: https://datasheet.ciiva.com/11746/0900766b80eb7fdd-11746365.pdf; Type: PCBPlug; Datasheet Version: Rev. W, 06/2004; Number of Contacts: 2; Flammability Rating: UL94V-0; Contact Plating: Tin; Length, Pin: 0.14 / "; Contact Mating Area Plating: Tin; Length, Overall: 0.2 / "; SuppliersPartNumber: C86502
L1 L3 = 0402 220R@100Mhz 0.1A: 220Ω @ 100MHz 1 2A 150mΩ 0805 Ferrite Beads ROHS; Notepad: *; Package: 0805; Supplier: LC; SuppliersPartNumber: C139188
P1 P20 = Header 2: Header, 2-Pin; Publisher: Altium Limited; LatestRevisionDate: 17-Jul-2002; LatestRevisionNote: Re-released for DXP Platform.; SuppliersPartNumber: C234182
P4#1 = 3.5mm Terminal Header 2p: Header,Male Pin,Covered(4 Sided) 2 1 0.138"（3.50mm） 2 P=3.5mm Pluggable System Terminal Block RoHS; UL_94_flammability_rating: V-0; Pitch_mm: 3.5 mm; ComponentLink1Description: Manufacturer URL; ComponentLink1URL: http://www.weidmueller.com/; Revision: V1; SuppliersPartNumber: C192777; Supplier: LCSC
P5#1 = 3.5mm Terminal Header 2p: Header,Male Pin,Covered(4 Sided) 2 1 0.138"（3.50mm） 2 P=3.5mm Pluggable System Terminal Block RoHS; Manufacturer: Weidmueller; Manufacturer 1: Weidmuller; Manufacturer Part Number 1: 1604470000; UL_94_flammability_rating: V-0; Pitch_mm: 3.5 mm; Side_termination_characteristic: closed side; Pitch_inch: 0.138 inch; Solder_pin_length_mm: 3.2 mm; Short_text_for_material: SL 3.50/02/180G 3.2SN OR BX; ComponentLink1Description: Manufacturer URL; ComponentLink1URL: http://www.weidmueller.com/; PartNumber: WJ15EDGVC-3.5-2P; Revision: V1; PackageReference: SL_3_50_180G_02; Packaging: Box; SuppliersPartNumber: C192777
P10 = Header 4: Header, 4-Pin; Supplier: LCSC; SuppliersPartNumber: C124378
P17 P19 = Header 3X2: Header, 3-Pin, Dual row; Publisher: Altium Limited; SuppliersPartNumber: C65114
Q10 = SOT-23 MMBT5551  G1: 三极管; ComponentLink1Description: 供应商链接; ComponentLink1URL: http://www.szlcsc.com/product/details_2502.html; Package: SOT-23; Supplier: LC; SuppliersPartNumber: C2145
R1 R43 R44 R79 = 0603 0R (0R0) 1%: Chip resistor; Manufacturer: Uniroyal Elec; PartNumber: 0603WAF0000T5E; Power: 1/10W; ComponentLink1Description: Supplier link; ComponentLink1URL: http://www.szlcsc.com/product/details_21903.html; Package: 0603; Supplier: LC; SuppliersPartNumber: C21189; Resistance: 0Ω; Tolerance: 1%
R18#1 R54 R55#1 R59 = 0603 10K (1002) 1%: Chip resistor; Manufacturer: Uniroyal Elec; PartNumber: 0603WAF1002T5E; Power: 1/10W; ComponentLink1Description: Supplier link; ComponentLink1URL: http://www.szlcsc.com/product/details_26547.html; Package: 0603; Supplier: LC; SuppliersPartNumber: C25804; Resistance: 10KΩ; Tolerance: 1%
R86 R88 = 0603 4.7K (4701) 1%: as R3#1 on sheet 2xparallelswitch; ComponentLink1Description: Supplier link; ComponentLink1URL: http://www.szlcsc.com/product/details_23889.html; Package: 0603; Supplier: LC; SuppliersPartNumber: C23162; Resistance: 4.7KΩ; Tolerance: 1%
U13#1 U15 U16 = ADUM1201ARZ-RL7_[C9669]: Dual Channel Isolator; Package: SOIC-8_150mil; Supplier: LC; SuppliersPartNumber: C476471
VR2 = TO-252-2 L78M05ABDT-TR: 500mA 55dB@(120Hz) Fixed 12V~12V Positive 1 35V TO-252-2(DPAK) Linear Voltage Regulators (LDO) ROHS; ComponentLink1Description: 供应商链接; ComponentLink1URL: http://www.szlcsc.com/product/details_59107.html; Package: TO-252-2; Supplier: digikey; SuppliersPartNumber: C16424

## Sheet Limit_Switches.SchDoc: RP2040 CNC
size B; Author: AM; CompanyName: Expatria Technologies; DrawnBy: A.Marles; Engineer: AM; Organization: Expatria Technolgoies; DocumentNumber: 7; Revision: A5; SheetNumber: 7; SheetTotal: 14
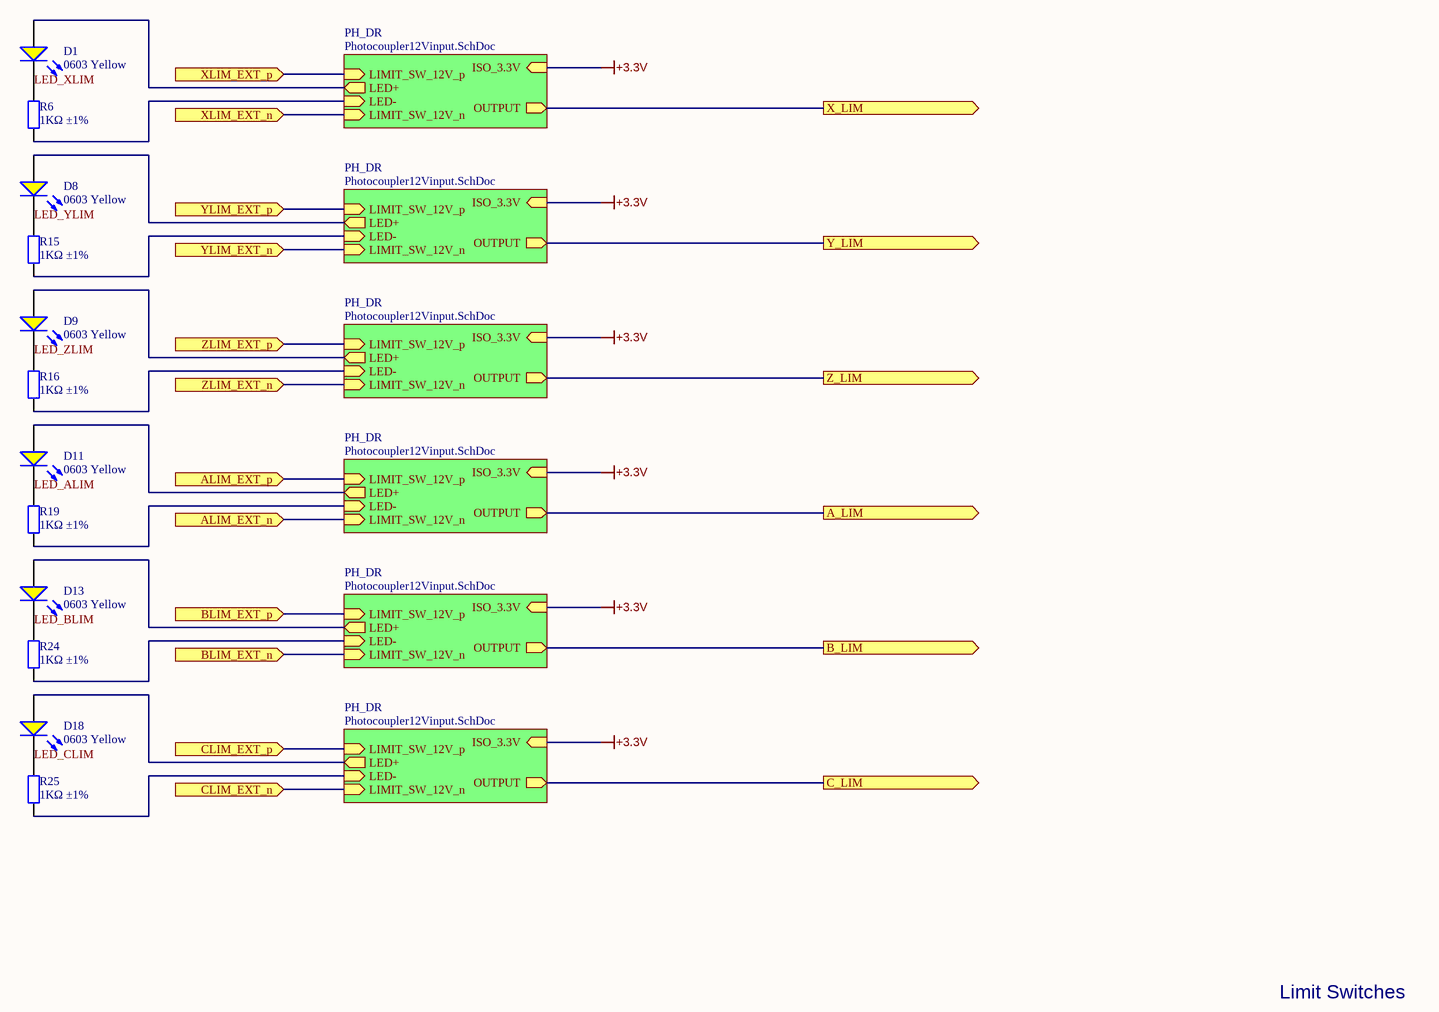
[diagram p3: Limit_Switches.SchDoc]

### Parts
(Parts that share a designator on the sheet are numbered #1, #2 ... from top to bottom, then left to right.)
D1  0603 Yellow  [0603_LED_S1]
D8  0603 Yellow  [0603_LED_S1]
D9#1  0603 Yellow  [0603_LED_S1]
D11#1  0603 Yellow  [0603_LED_S1]
D13  0603 Yellow  [0603_LED_S1]
D18  0603 Yellow  [0603_LED_S1]
R6  1KΩ ±1%  [0603_R]
R15  1KΩ ±1%  [0603_R]
R16  1KΩ ±1%  [0603_R]
R19#1  1KΩ ±1%  [0603_R]
R24#1  1KΩ ±1%  [0603_R]
R25#1  1KΩ ±1%  [0603_R]

### Sub-sheets
PH_DR = Photocoupler12Vinput.SchDoc: OUTPUT (out), LED+ (out), LED- (in), ISO_3.3V (in), LIMIT_SW_12V_n (in), LIMIT_SW_12V_p (in)
PH_DR = Photocoupler12Vinput.SchDoc: OUTPUT (out), LED+ (out), LED- (in), ISO_3.3V (in), LIMIT_SW_12V_n (in), LIMIT_SW_12V_p (in)
PH_DR = Photocoupler12Vinput.SchDoc: OUTPUT (out), LED+ (out), LED- (in), ISO_3.3V (in), LIMIT_SW_12V_n (in), LIMIT_SW_12V_p (in)
PH_DR = Photocoupler12Vinput.SchDoc: OUTPUT (out), LED+ (out), LED- (in), ISO_3.3V (in), LIMIT_SW_12V_n (in), LIMIT_SW_12V_p (in)
PH_DR = Photocoupler12Vinput.SchDoc: OUTPUT (out), LED+ (out), LED- (in), ISO_3.3V (in), LIMIT_SW_12V_n (in), LIMIT_SW_12V_p (in)
PH_DR = Photocoupler12Vinput.SchDoc: OUTPUT (out), LED+ (out), LED- (in), ISO_3.3V (in), LIMIT_SW_12V_n (in), LIMIT_SW_12V_p (in)

### Ports
A_LIM (out), ALIM_EXT_n (in), ALIM_EXT_p (in), B_LIM (out), BLIM_EXT_n (in), BLIM_EXT_p (in), C_LIM (out), CLIM_EXT_n (in), CLIM_EXT_p (in), X_LIM (out), XLIM_EXT_n (in), XLIM_EXT_p (in), Y_LIM (out), YLIM_EXT_n (in), YLIM_EXT_p (in), Z_LIM (out), ZLIM_EXT_n (in), ZLIM_EXT_p (in)

### Nets
+3.3V: D1.A D8.A D9#1.A D11#1.A D13.A D18.A ; sheet PH_DR/LED+, sheet PH_DR/ISO_3.3V, sheet PH_DR/LED+, sheet PH_DR/ISO_3.3V, sheet PH_DR/LED+, sheet PH_DR/ISO_3.3V, sheet PH_DR/LED+, sheet PH_DR/ISO_3.3V, sheet PH_DR/LED+, sheet PH_DR/ISO_3.3V, sheet PH_DR/LED+, sheet PH_DR/ISO_3.3V
A_LIM: R19#1.2 ; port A_LIM, sheet PH_DR/OUTPUT, sheet PH_DR/LED-
ALIM_EXT_n: port ALIM_EXT_n, sheet PH_DR/LIMIT_SW_12V_n
ALIM_EXT_p: port ALIM_EXT_p, sheet PH_DR/LIMIT_SW_12V_p
B_LIM: R24#1.2 ; port B_LIM, sheet PH_DR/OUTPUT, sheet PH_DR/LED-
BLIM_EXT_n: port BLIM_EXT_n, sheet PH_DR/LIMIT_SW_12V_n
BLIM_EXT_p: port BLIM_EXT_p, sheet PH_DR/LIMIT_SW_12V_p
C_LIM: R25#1.2 ; port C_LIM, sheet PH_DR/OUTPUT, sheet PH_DR/LED-
CLIM_EXT_n: port CLIM_EXT_n, sheet PH_DR/LIMIT_SW_12V_n
CLIM_EXT_p: port CLIM_EXT_p, sheet PH_DR/LIMIT_SW_12V_p
LED_ALIM: D11#1.K R19#1.1
LED_BLIM: D13.K R24#1.1
LED_CLIM: D18.K R25#1.1
LED_XLIM: D1.K R6.1
LED_YLIM: D8.K R15.1
LED_ZLIM: D9#1.K R16.1
X_LIM: R6.2 ; port X_LIM, sheet PH_DR/OUTPUT, sheet PH_DR/LED-
XLIM_EXT_n: port XLIM_EXT_n, sheet PH_DR/LIMIT_SW_12V_n
XLIM_EXT_p: port XLIM_EXT_p, sheet PH_DR/LIMIT_SW_12V_p
Y_LIM: R15.2 ; port Y_LIM, sheet PH_DR/OUTPUT, sheet PH_DR/LED-
YLIM_EXT_n: port YLIM_EXT_n, sheet PH_DR/LIMIT_SW_12V_n
YLIM_EXT_p: port YLIM_EXT_p, sheet PH_DR/LIMIT_SW_12V_p
Z_LIM: R16.2 ; port Z_LIM, sheet PH_DR/OUTPUT, sheet PH_DR/LED-
ZLIM_EXT_n: port ZLIM_EXT_n, sheet PH_DR/LIMIT_SW_12V_n
ZLIM_EXT_p: port ZLIM_EXT_p, sheet PH_DR/LIMIT_SW_12V_p

### Notes on the sheet
- Limit Switches
- SHEET
- Expatria Technologies
- 1136 Glade Court
- Port Coquitlam, BC V3B 1R5
- PROJECT
- SIZE
- ENGR
- MODIFIED
- DOCUMENT
- REV
- Copyright Expatria Technologies 2022. This document describes Open Hardware and is licensed under the CERN-OHL-S v2. No warranty is implied or expressed.
- EMAIL: INFO@EXPATRIA.CA
- B
- /

### Library data of the parts
D1 D8 D9#1 D11#1 D13 D18 = 0603 LED Yellow: LED; ComponentLink1Description: 供应商链接; ComponentLink1URL: http://www.szlcsc.com/product/details_73147.html; Package: 0603; Supplier: LC; SuppliersPartNumber: C72038; Color: Yellow
R6 R15 R16 R19#1 R24#1 R25#1 = 0603 1K (1001) 1%: Chip resistor; Manufacturer: Uniroyal Elec; PartNumber: 0603WAF1001T5E; Power: 1/10W; ComponentLink1Description: Supplier link; ComponentLink1URL: http://www.szlcsc.com/product/details_21904.html; Package: 0603; Supplier: LC; SuppliersPartNumber: C21190; Resistance: 1KΩ; Tolerance: 1%

## Sheet Photocoupler12Vinput.SchDoc: STM32F446 CNC
size B; Author: AM; CompanyName: Expatria Technologies; DrawnBy: A.Marles; Engineer: AM; Organization: Expatria Technolgoies; DocumentNumber: 14; Revision: A5; SheetNumber: 14; SheetTotal: 14
Used 11 times, as channels LIM_SW/PH_DR, LIM_SW/PH_DR, LIM_SW/PH_DR, LIM_SW/PH_DR, LIM_SW/PH_DR, LIM_SW/PH_DR, USR_SW/PH_CY, USR_SW/PH_FD, USR_SW/PH_DR, USR_SW/PH_TL, USR_SW/PH_PR. Parts and nets are listed once, with the designators drawn on the sheet.
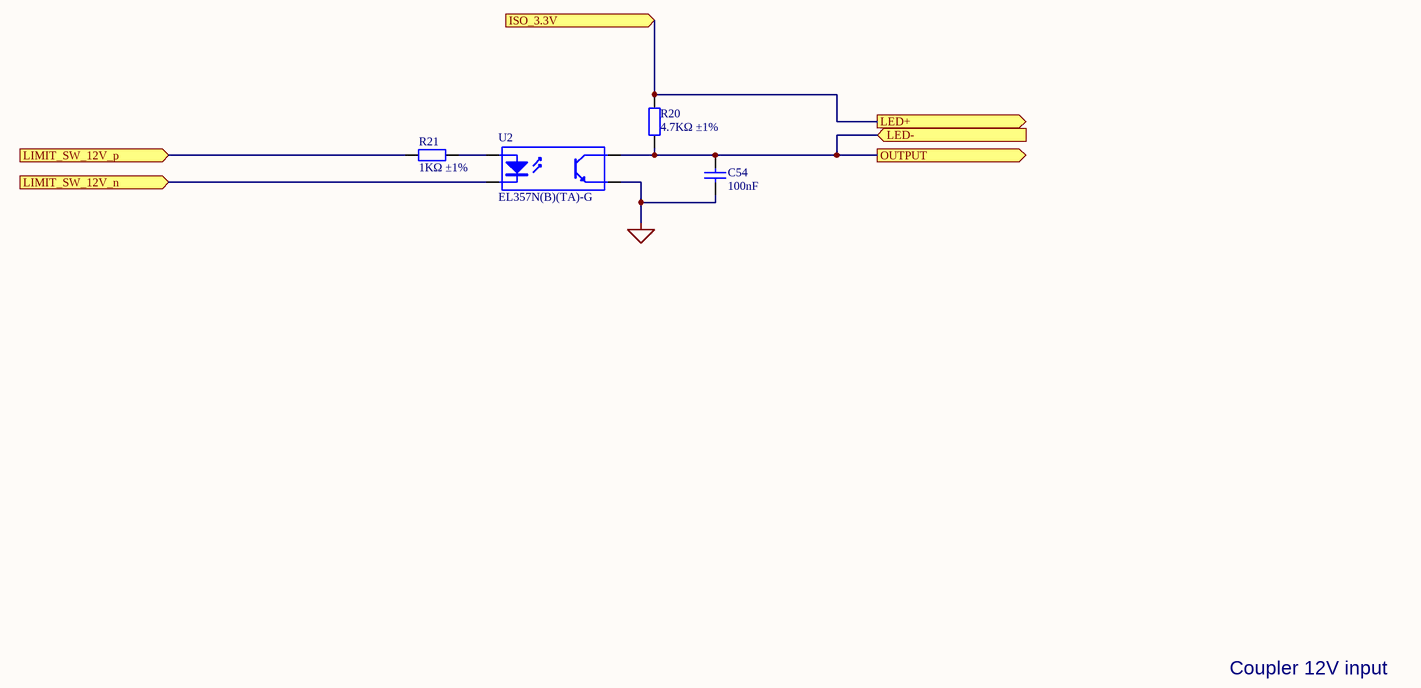
[diagram p4: Photocoupler12Vinput.SchDoc]

### Parts
C54  100nF  [0603_C]
R20  4.7KΩ ±1%  [0603_R]
R21  1KΩ ±1%  [0603_R]
U2  EL357N(B)(TA)-G  [SOP-4_P2.54]

### Ports
ISO_3.3V (in), LED+ (out), LED- (in), LIMIT_SW_12V_n (in), LIMIT_SW_12V_p (in), OUTPUT (out)

### Nets
MCU_GND: C54.1 U2.3(E)
ISO_3.3V: R20.2 ; port LED+, port ISO_3.3V
LED-: C54.2 R20.1 U2.4(C) ; port OUTPUT, port LED-
LIMIT_SW_12V_n: U2.2(K) ; port LIMIT_SW_12V_n
LIMIT_SW_12V_p: R21.1 ; port LIMIT_SW_12V_p
NetR21_2: R21.2 U2.1(A)

### Channels
LIM_SW/PH_DR: designators end in _LIM_SW_PH_DR#1; ports ISO_3.3V=+3.3V LED+=+3.3V LED-=X_LIM LIMIT_SW_12V_n=XLIM_EXT_n LIMIT_SW_12V_p=XLIM_EXT_p OUTPUT=X_LIM
LIM_SW/PH_DR: designators end in _LIM_SW_PH_DR#2; ports ISO_3.3V=+3.3V LED+=+3.3V LED-=Y_LIM LIMIT_SW_12V_n=YLIM_EXT_n LIMIT_SW_12V_p=YLIM_EXT_p OUTPUT=Y_LIM
LIM_SW/PH_DR: designators end in _LIM_SW_PH_DR#3; ports ISO_3.3V=+3.3V LED+=+3.3V LED-=Z_LIM LIMIT_SW_12V_n=ZLIM_EXT_n LIMIT_SW_12V_p=ZLIM_EXT_p OUTPUT=Z_LIM
LIM_SW/PH_DR: designators end in _LIM_SW_PH_DR#4; ports ISO_3.3V=+3.3V LED+=+3.3V LED-=A_LIM LIMIT_SW_12V_n=ALIM_EXT_n LIMIT_SW_12V_p=ALIM_EXT_p OUTPUT=A_LIM
LIM_SW/PH_DR: designators end in _LIM_SW_PH_DR#5; ports ISO_3.3V=+3.3V LED+=+3.3V LED-=B_LIM LIMIT_SW_12V_n=BLIM_EXT_n LIMIT_SW_12V_p=BLIM_EXT_p OUTPUT=B_LIM
LIM_SW/PH_DR: designators end in _LIM_SW_PH_DR#6; ports ISO_3.3V=+3.3V LED+=+3.3V LED-=C_LIM LIMIT_SW_12V_n=CLIM_EXT_n LIMIT_SW_12V_p=CLIM_EXT_p OUTPUT=C_LIM
USR_SW/PH_CY: designators end in _PH_CY; ports ISO_3.3V=+3.3V LED+=+3.3V LED-=CYC/ST LIMIT_SW_12V_n=RUN_EXT_n LIMIT_SW_12V_p=RUN_EXT_p OUTPUT=CYC/ST
USR_SW/PH_FD: designators end in _PH_FD; ports ISO_3.3V=+3.3V LED+=+3.3V LED-=FD/HLD LIMIT_SW_12V_n=HOLD_EXT_n LIMIT_SW_12V_p=HOLD_EXT_p OUTPUT=FD/HLD
USR_SW/PH_DR: designators end in _USR_SW_PH_DR; ports ISO_3.3V=+3.3V LED+=+3.3V LED-=DOOR LIMIT_SW_12V_n=DOOR_EXT_n LIMIT_SW_12V_p=DOOR_EXT_p OUTPUT=DOOR
USR_SW/PH_TL: designators end in _PH_TL; ports ISO_3.3V=+3.3V LED+=+3.3V LED-=TOOL LIMIT_SW_12V_n=TOOL_EXT_n LIMIT_SW_12V_p=TOOL_EXT_p OUTPUT=TOOL
USR_SW/PH_PR: designators end in _PH_PR; ports ISO_3.3V=+3.3V LED+=+3.3V LED-=PROBE LIMIT_SW_12V_n=PROBE_EXT_n LIMIT_SW_12V_p=PROBE_EXT_p OUTPUT=PROBE

### Notes on the sheet
- Coupler 12V input
- SHEET
- Expatria Technologies
- 1136 Glade Court
- Port Coquitlam, BC V3B 1R5
- PROJECT
- SIZE
- ENGR
- MODIFIED
- DOCUMENT
- REV
- Copyright Expatria Technologies 2022. This document describes Open Hardware and is licensed under the CERN-OHL-S v2. No warranty is implied or expressed.
- EMAIL: INFO@EXPATRIA.CA
- B
- /

### Library data of the parts
C54 = 0603 100nF (104) 10% 50V: as C5#1 on sheet 2xparallelswitch; ComponentLink1Description: Supplier link; ComponentLink1URL: http://www.szlcsc.com/product/details_15331.html; Package: 0603; Supplier: LC; SuppliersPartNumber: C14663; Capacitance: 100nF
R20 = 0603 4.7K (4701) 1%: as R3#1 on sheet 2xparallelswitch; ComponentLink1Description: Supplier link; ComponentLink1URL: http://www.szlcsc.com/product/details_23889.html; Package: 0603; Supplier: LC; SuppliersPartNumber: C23162; Resistance: 4.7KΩ; Tolerance: 1%
R21 = 0603 1K (1001) 1%: as R6 on sheet Limit_Switches; ComponentLink1Description: Supplier link; ComponentLink1URL: http://www.szlcsc.com/product/details_21904.html; Package: 0603; Supplier: LC; SuppliersPartNumber: C21190; Resistance: 1KΩ; Tolerance: 1%
U2 = EL357N(B)(TA)-G_[C6649]: OPTOISOLATOR 3.75KV TRANS 4-SOP; Manufacturer 1: Everlight Elec; ComponentLink1Description: 供应商链接; ComponentLink1URL: http://www.szlcsc.com/product/details_7114.html; Package: SOP-4_P2.54; Supplier: LC; SuppliersPartNumber: C6649; Manufacturer Part Number 1: EL357N(B)(TA)-G

## Sheet Misc_switches.SchDoc: RP2040 CNC
size B; Author: AM; CompanyName: Expatria Technologies; DrawnBy: A.Marles; Engineer: AM; Organization: Expatria Technolgoies; DocumentNumber: 8; Revision: A5; SheetNumber: 8; SheetTotal: 14
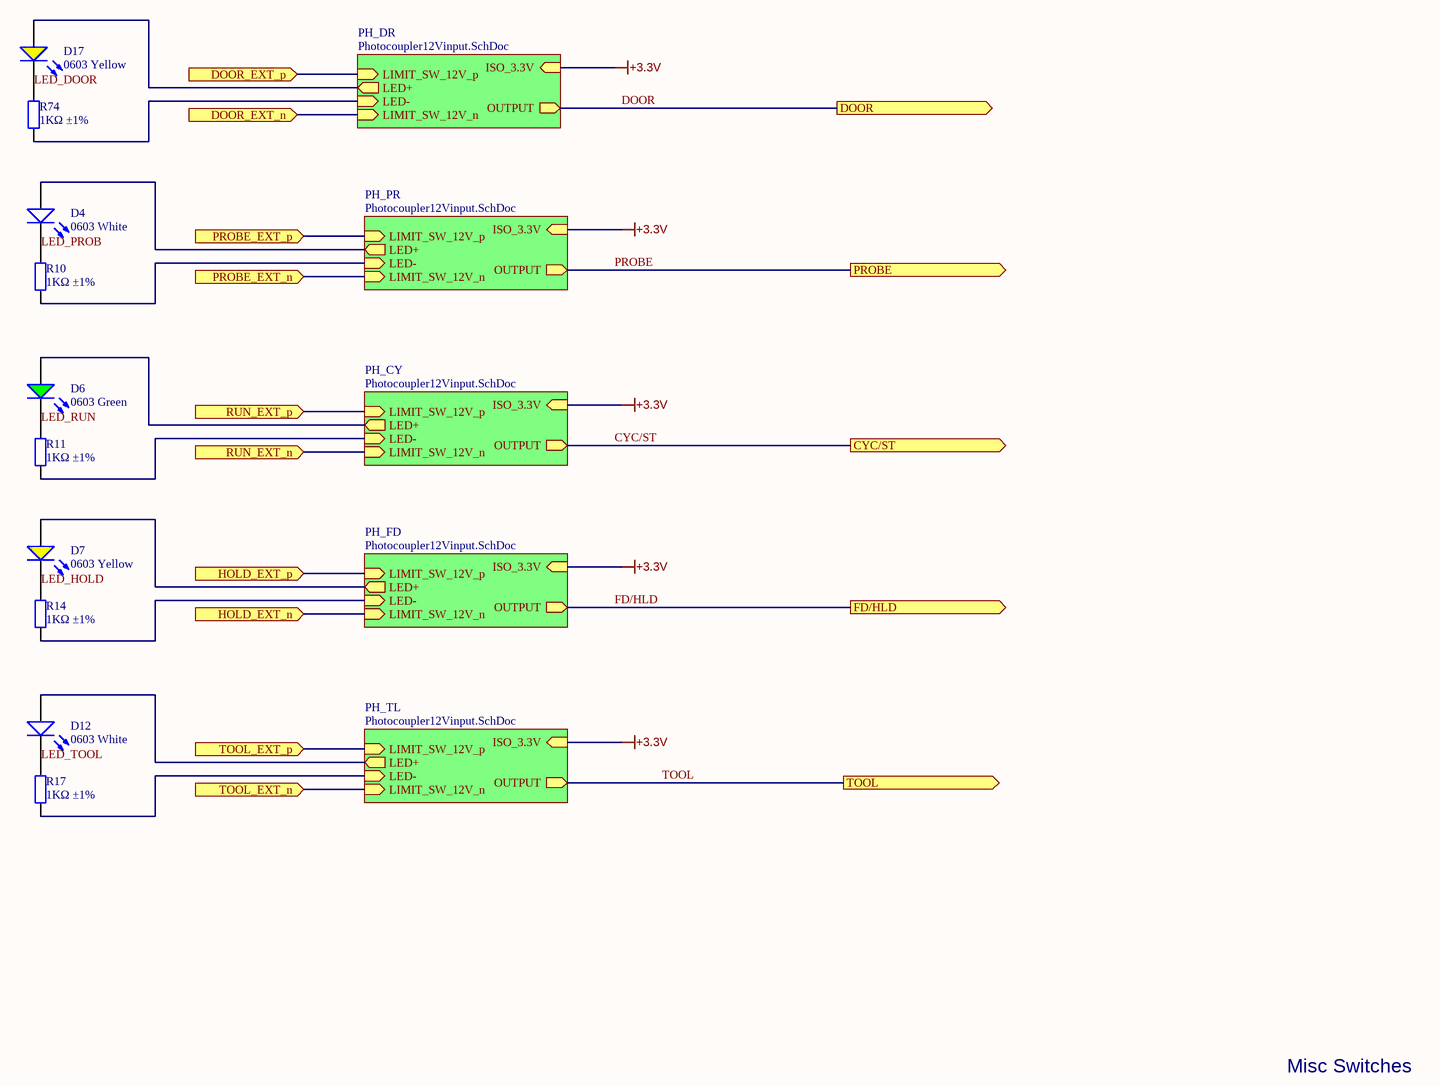
[diagram p5: Misc_switches.SchDoc]

### Parts
(Parts that share a designator on the sheet are numbered #1, #2 ... from top to bottom, then left to right.)
D4  0603 White  [0603_LED_S1]
D6  0603 Green  [0603_LED_S1]
D7  0603 Yellow  [0603_LED_S1]
D12#1  0603 White  [0603_LED_S1]
D17  0603 Yellow  [0603_LED_S1]
R10  1KΩ ±1%  [0603_R]
R11  1KΩ ±1%  [0603_R]
R14  1KΩ ±1%  [0603_R]
R17#1  1KΩ ±1%  [0603_R]
R74  1KΩ ±1%  [0603_R]

### Sub-sheets
PH_CY = Photocoupler12Vinput.SchDoc: OUTPUT (out), LED- (in), LED+ (out), ISO_3.3V (in), LIMIT_SW_12V_n (in), LIMIT_SW_12V_p (in)
PH_DR = Photocoupler12Vinput.SchDoc: OUTPUT (out), LED+ (out), LED- (in), ISO_3.3V (in), LIMIT_SW_12V_n (in), LIMIT_SW_12V_p (in)
PH_FD = Photocoupler12Vinput.SchDoc: OUTPUT (out), LED+ (out), LED- (in), ISO_3.3V (in), LIMIT_SW_12V_n (in), LIMIT_SW_12V_p (in)
PH_PR = Photocoupler12Vinput.SchDoc: OUTPUT (out), LED+ (out), LED- (in), ISO_3.3V (in), LIMIT_SW_12V_n (in), LIMIT_SW_12V_p (in)
PH_TL = Photocoupler12Vinput.SchDoc: OUTPUT (out), LED+ (out), LED- (in), ISO_3.3V (in), LIMIT_SW_12V_n (in), LIMIT_SW_12V_p (in)

### Ports
CYC/ST (out), DOOR (out), DOOR_EXT_n (in), DOOR_EXT_p (in), FD/HLD (out), HOLD_EXT_n (in), HOLD_EXT_p (in), PROBE (out), PROBE_EXT_n (in), PROBE_EXT_p (in), RUN_EXT_n (in), RUN_EXT_p (in), TOOL (out), TOOL_EXT_n (in), TOOL_EXT_p (in)

### Nets
+3.3V: D4.A D6.A D7.A D12#1.A D17.A ; sheet PH_CY/LED+, sheet PH_CY/ISO_3.3V, sheet PH_FD/LED+, sheet PH_FD/ISO_3.3V, sheet PH_DR/LED+, sheet PH_DR/ISO_3.3V, sheet PH_TL/LED+, sheet PH_TL/ISO_3.3V, sheet PH_PR/LED+, sheet PH_PR/ISO_3.3V
CYC/ST: R11.2 ; port CYC/ST, sheet PH_CY/OUTPUT, sheet PH_CY/LED-
DOOR: R74.2 ; port DOOR, sheet PH_DR/OUTPUT, sheet PH_DR/LED-
DOOR_EXT_n: port DOOR_EXT_n, sheet PH_DR/LIMIT_SW_12V_n
DOOR_EXT_p: port DOOR_EXT_p, sheet PH_DR/LIMIT_SW_12V_p
FD/HLD: R14.2 ; port FD/HLD, sheet PH_FD/OUTPUT, sheet PH_FD/LED-
HOLD_EXT_n: port HOLD_EXT_n, sheet PH_FD/LIMIT_SW_12V_n
HOLD_EXT_p: port HOLD_EXT_p, sheet PH_FD/LIMIT_SW_12V_p
LED_DOOR: D17.K R74.1
LED_HOLD: D7.K R14.1
LED_PROB: D4.K R10.1
LED_RUN: D6.K R11.1
LED_TOOL: D12#1.K R17#1.1
PROBE: R10.2 ; port PROBE, sheet PH_PR/OUTPUT, sheet PH_PR/LED-
PROBE_EXT_n: port PROBE_EXT_n, sheet PH_PR/LIMIT_SW_12V_n
PROBE_EXT_p: port PROBE_EXT_p, sheet PH_PR/LIMIT_SW_12V_p
RUN_EXT_n: port RUN_EXT_n, sheet PH_CY/LIMIT_SW_12V_n
RUN_EXT_p: port RUN_EXT_p, sheet PH_CY/LIMIT_SW_12V_p
TOOL: R17#1.2 ; port TOOL, sheet PH_TL/OUTPUT, sheet PH_TL/LED-
TOOL_EXT_n: port TOOL_EXT_n, sheet PH_TL/LIMIT_SW_12V_n
TOOL_EXT_p: port TOOL_EXT_p, sheet PH_TL/LIMIT_SW_12V_p

### Notes on the sheet
- Misc Switches
- SHEET
- Expatria Technologies
- 1136 Glade Court
- Port Coquitlam, BC V3B 1R5
- PROJECT
- SIZE
- ENGR
- MODIFIED
- DOCUMENT
- REV
- Copyright Expatria Technologies 2022. This document describes Open Hardware and is licensed under the CERN-OHL-S v2. No warranty is implied or expressed.
- EMAIL: INFO@EXPATRIA.CA
- B
- /

### Library data of the parts
D4 D12#1 = 0603 LED White: LED; ComponentLink1Description: 供应商链接; ComponentLink1URL: http://www.szlcsc.com/product/details_2663.html; Package: 0603; Supplier: LC; SuppliersPartNumber: C2290; Color: White
D6 = 0603 LED Green: LED; ComponentLink1Description: 供应商链接; ComponentLink1URL: http://www.szlcsc.com/product/details_73152.html; Package: 0603; Supplier: LC; SuppliersPartNumber: C72043; Color: Green
D7 D17 = 0603 LED Yellow: LED; ComponentLink1Description: 供应商链接; ComponentLink1URL: http://www.szlcsc.com/product/details_73147.html; Package: 0603; Supplier: LC; SuppliersPartNumber: C72038; Color: Yellow
R10 R11 R14 R17#1 R74 = 0603 1K (1001) 1%: as R6 on sheet Limit_Switches; ComponentLink1Description: Supplier link; ComponentLink1URL: http://www.szlcsc.com/product/details_21904.html; Package: 0603; Supplier: LC; SuppliersPartNumber: C21190; Resistance: 1KΩ; Tolerance: 1%

## Sheet Stepper_driver_group.SchDoc: STM32F446 CNC
size B; Author: AM; CompanyName: Expatria Technologies; DrawnBy: A.Marles; Engineer: AM; Organization: Expatria Technologies; DocumentNumber: 4; Revision: A5; SheetNumber: 4; SheetTotal: 14
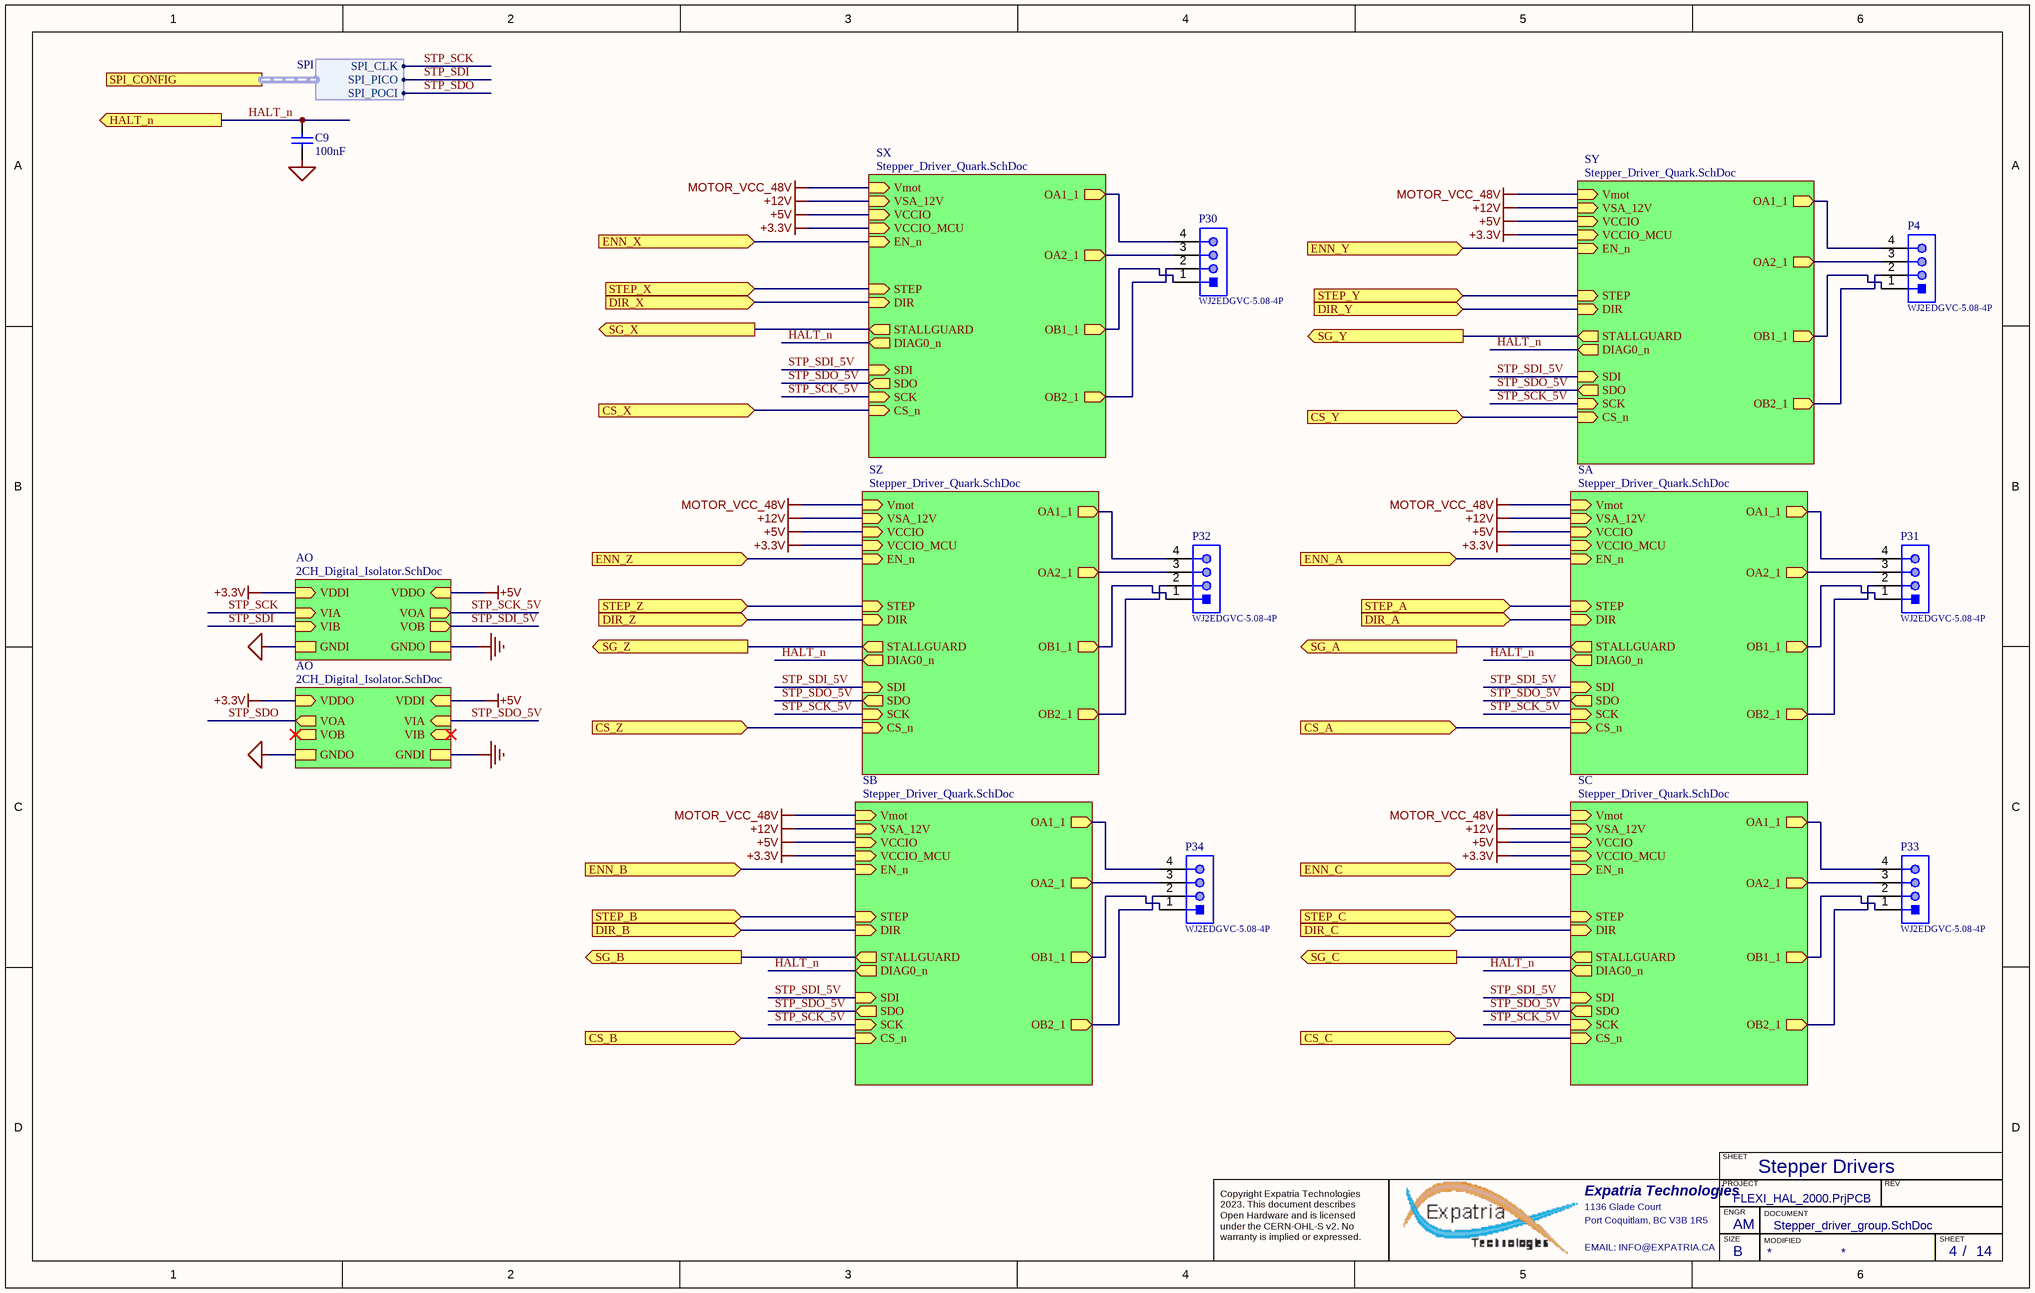
[diagram p6: Stepper_driver_group.SchDoc]

### Parts
(Parts that share a designator on the sheet are numbered #1, #2 ... from top to bottom, then left to right.)
C9#1  100nF  [0603_C]
P4#2  WJ2EDGVC-5.08-4P  [WJ2EDGVC-5.08-4P]
P30  WJ2EDGVC-5.08-4P  [WJ2EDGVC-5.08-4P]
P31  WJ2EDGVC-5.08-4P  [WJ2EDGVC-5.08-4P]
P32  WJ2EDGVC-5.08-4P  [WJ2EDGVC-5.08-4P]
P33  WJ2EDGVC-5.08-4P  [WJ2EDGVC-5.08-4P]
P34  WJ2EDGVC-5.08-4P  [WJ2EDGVC-5.08-4P]

### Sub-sheets
AO = 2CH_Digital_Isolator.SchDoc (file not in this document): VDDO (in), VIB (in), VIA (in), VOB (out), VOA (out), VDDI (in), GNDO, GNDI
AO = 2CH_Digital_Isolator.SchDoc (file not in this document): VDDO (in), VIB (in), VIA (in), VOB (out), VOA (out), VDDI (in), GNDO, GNDI
SA = Stepper_Driver_Quark.SchDoc (file not in this document): SCK (in), EN_n (in), OB1_1 (out), STEP (in), OB2_1 (out), DIR (in), STALLGUARD (out), SDI (in), SDO (out), OA1_1 (out), OA2_1 (out), CS_n (in), Vmot (in), VSA_12V (in), VCCIO (in), VCCIO_MCU (in), DIAG0_n (out)
SB = Stepper_Driver_Quark.SchDoc (file not in this document): SCK (in), EN_n (in), OB1_1 (out), STEP (in), OB2_1 (out), DIR (in), STALLGUARD (out), SDI (in), SDO (out), OA1_1 (out), OA2_1 (out), CS_n (in), Vmot (in), VSA_12V (in), VCCIO (in), VCCIO_MCU (in), DIAG0_n (out)
SC = Stepper_Driver_Quark.SchDoc (file not in this document): SCK (in), EN_n (in), OB1_1 (out), STEP (in), OB2_1 (out), DIR (in), STALLGUARD (out), SDI (in), SDO (out), OA1_1 (out), OA2_1 (out), CS_n (in), Vmot (in), VSA_12V (in), VCCIO (in), VCCIO_MCU (in), DIAG0_n (out)
SX = Stepper_Driver_Quark.SchDoc (file not in this document): SCK (in), EN_n (in), OB1_1 (out), STEP (in), OB2_1 (out), DIR (in), STALLGUARD (out), SDI (in), SDO (out), OA1_1 (out), OA2_1 (out), CS_n (in), Vmot (in), VSA_12V (in), VCCIO (in), VCCIO_MCU (in), DIAG0_n (out)
SY = Stepper_Driver_Quark.SchDoc (file not in this document): SCK (in), EN_n (in), OB1_1 (out), STEP (in), OB2_1 (out), DIR (in), STALLGUARD (out), SDI (in), OA1_1 (out), OA2_1 (out), CS_n (in), Vmot (in), VSA_12V (in), VCCIO (in), VCCIO_MCU (in), SDO (out), DIAG0_n (out)
SZ = Stepper_Driver_Quark.SchDoc (file not in this document): SCK (in), EN_n (in), OB1_1 (out), STEP (in), OB2_1 (out), DIR (in), STALLGUARD (out), SDI (in), SDO (out), OA1_1 (out), OA2_1 (out), CS_n (in), Vmot (in), VSA_12V (in), VCCIO (in), VCCIO_MCU (in), DIAG0_n (out)

### Ports
CS_A (in), CS_B (in), CS_C (in), CS_X (in), CS_Y (in), CS_Z (in), DIR_A (in), DIR_B (in), DIR_C (in), DIR_X (in), DIR_Y (in), DIR_Z (in), ENN_A (in), ENN_B (in), ENN_C (in), ENN_X (in), ENN_Y (in), ENN_Z (in), HALT_n (out), SG_A (out), SG_B (out), SG_C (out), SG_X (out), SG_Y (out), SG_Z (out), SPI_CONFIG (harness SPI), STEP_A (in), STEP_B (in), STEP_C (in), STEP_X (in), STEP_Y (in), STEP_Z (in)

### Harnesses
SPI: SPI_CLK, SPI_PICO, SPI_POCI

### Nets
+3.3V: sheet SX/VCCIO_MCU, sheet SY/VCCIO_MCU, sheet SZ/VCCIO_MCU, sheet SA/VCCIO_MCU, sheet SB/VCCIO_MCU, sheet SC/VCCIO_MCU, sheet AO/VDDI, sheet AO/VDDO
+5V: sheet SX/VCCIO, sheet SY/VCCIO, sheet SZ/VCCIO, sheet SA/VCCIO, sheet SB/VCCIO, sheet SC/VCCIO, sheet AO/VDDO, sheet AO/VDDI
+12V: sheet SX/VSA_12V, sheet SY/VSA_12V, sheet SZ/VSA_12V, sheet SA/VSA_12V, sheet SB/VSA_12V, sheet SC/VSA_12V
GND: sheet AO/GNDO, sheet AO/GNDI
MCU_GND: C9#1.2 ; sheet AO/GNDI, sheet AO/GNDO
MOTOR_VCC_48V: sheet SX/Vmot, sheet SY/Vmot, sheet SZ/Vmot, sheet SA/Vmot, sheet SB/Vmot, sheet SC/Vmot
CS_A: port CS_A, sheet SA/CS_n
CS_B: port CS_B, sheet SB/CS_n
CS_C: port CS_C, sheet SC/CS_n
CS_X: port CS_X, sheet SX/CS_n
CS_Y: port CS_Y, sheet SY/CS_n
CS_Z: port CS_Z, sheet SZ/CS_n
DIR_A: port DIR_A, sheet SA/DIR
DIR_B: port DIR_B, sheet SB/DIR
DIR_C: port DIR_C, sheet SC/DIR
DIR_X: port DIR_X, sheet SX/DIR
DIR_Y: port DIR_Y, sheet SY/DIR
DIR_Z: port DIR_Z, sheet SZ/DIR
ENN_A: port ENN_A, sheet SA/EN_n
ENN_B: port ENN_B, sheet SB/EN_n
ENN_C: port ENN_C, sheet SC/EN_n
ENN_X: port ENN_X, sheet SX/EN_n
ENN_Y: port ENN_Y, sheet SY/EN_n
ENN_Z: port ENN_Z, sheet SZ/EN_n
HALT_n: C9#1.1 ; port HALT_n, sheet SX/DIAG0_n, sheet SY/DIAG0_n, sheet SZ/DIAG0_n, sheet SA/DIAG0_n, sheet SB/DIAG0_n, sheet SC/DIAG0_n
SG_A: port SG_A, sheet SA/STALLGUARD
SG_B: port SG_B, sheet SB/STALLGUARD
SG_C: port SG_C, sheet SC/STALLGUARD
SG_X: port SG_X, sheet SX/STALLGUARD
SG_Y: port SG_Y, sheet SY/STALLGUARD
SG_Z: port SG_Z, sheet SZ/STALLGUARD
STEP_A: port STEP_A, sheet SA/STEP
STEP_B: port STEP_B, sheet SB/STEP
STEP_C: port STEP_C, sheet SC/STEP
STEP_X: port STEP_X, sheet SX/STEP
STEP_Y: port STEP_Y, sheet SY/STEP
STEP_Z: port STEP_Z, sheet SZ/STEP
STP_SCK: sheet AO/VIA, port SPI_CONFIG.SPI_CLK
STP_SCK_5V: sheet SX/SCK, sheet SY/SCK, sheet SZ/SCK, sheet SA/SCK, sheet SB/SCK, sheet SC/SCK, sheet AO/VOA
STP_SDI: sheet AO/VIB, port SPI_CONFIG.SPI_PICO
STP_SDI_5V: sheet SX/SDI, sheet SY/SDI, sheet SZ/SDI, sheet SA/SDI, sheet SB/SDI, sheet SC/SDI, sheet AO/VOB
STP_SDO: sheet AO/VOA, port SPI_CONFIG.SPI_POCI
STP_SDO_5V: sheet SX/SDO, sheet SY/SDO, sheet SZ/SDO, sheet SA/SDO, sheet SB/SDO, sheet SC/SDO, sheet AO/VIA
NetP4#2_1: P4#2.1 ; sheet SY/OB1_1
NetP4#2_2: P4#2.2 ; sheet SY/OB2_1
NetP4#2_3: P4#2.3 ; sheet SY/OA2_1
NetP4#2_4: P4#2.4 ; sheet SY/OA1_1
NetP30_1: P30.1 ; sheet SX/OB1_1
NetP30_2: P30.2 ; sheet SX/OB2_1
NetP30_3: P30.3 ; sheet SX/OA2_1
NetP30_4: P30.4 ; sheet SX/OA1_1
NetP31_1: P31.1 ; sheet SA/OB1_1
NetP31_2: P31.2 ; sheet SA/OB2_1
NetP31_3: P31.3 ; sheet SA/OA2_1
NetP31_4: P31.4 ; sheet SA/OA1_1
NetP32_1: P32.1 ; sheet SZ/OB1_1
NetP32_2: P32.2 ; sheet SZ/OB2_1
NetP32_3: P32.3 ; sheet SZ/OA2_1
NetP32_4: P32.4 ; sheet SZ/OA1_1
NetP33_1: P33.1 ; sheet SC/OB1_1
NetP33_2: P33.2 ; sheet SC/OB2_1
NetP33_3: P33.3 ; sheet SC/OA2_1
NetP33_4: P33.4 ; sheet SC/OA1_1
NetP34_1: P34.1 ; sheet SB/OB1_1
NetP34_2: P34.2 ; sheet SB/OB2_1
NetP34_3: P34.3 ; sheet SB/OA2_1
NetP34_4: P34.4 ; sheet SB/OA1_1

### Notes on the sheet
- Stepper Drivers
- SHEET
- Expatria Technologies
- 1136 Glade Court
- Port Coquitlam, BC V3B 1R5
- PROJECT
- SIZE
- ENGR
- MODIFIED
- DOCUMENT
- REV
- Copyright Expatria Technologies 2023. This document describes Open Hardware and is licensed under the CERN-OHL-S v2. No warranty is implied or expressed.
- EMAIL: INFO@EXPATRIA.CA
- B
- /

### Library data of the parts
C9#1 = 0603 100nF (104) 10% 50V: as C5#1 on sheet 2xparallelswitch; ComponentLink1Description: Supplier link; ComponentLink1URL: http://www.szlcsc.com/product/details_15331.html; Package: 0603; Supplier: LC; SuppliersPartNumber: C14663; Capacitance: 100nF
P4#2 P30-P34 = WJ2EDGVC-5.08-4P: 4 Straight pin 1 5.08mm Green Board Edge/Receptacle-Close Straight,P=5.08mm Pluggable System Terminal Block ROHS; Manufacturer: Ningbo Kangnex Elec; Supplier Part Number 1: C8436; Manufacturer Part Number: WJ2EDGVC-5.08-4P; RoHS: Yes; Category: Terminals; SuppliersPartNumber: C8436; Supplier 1: LCSC